# EAGLE design uniprog21 (EAGLE 6.4)

## Sheet 1 of 5: ZIF
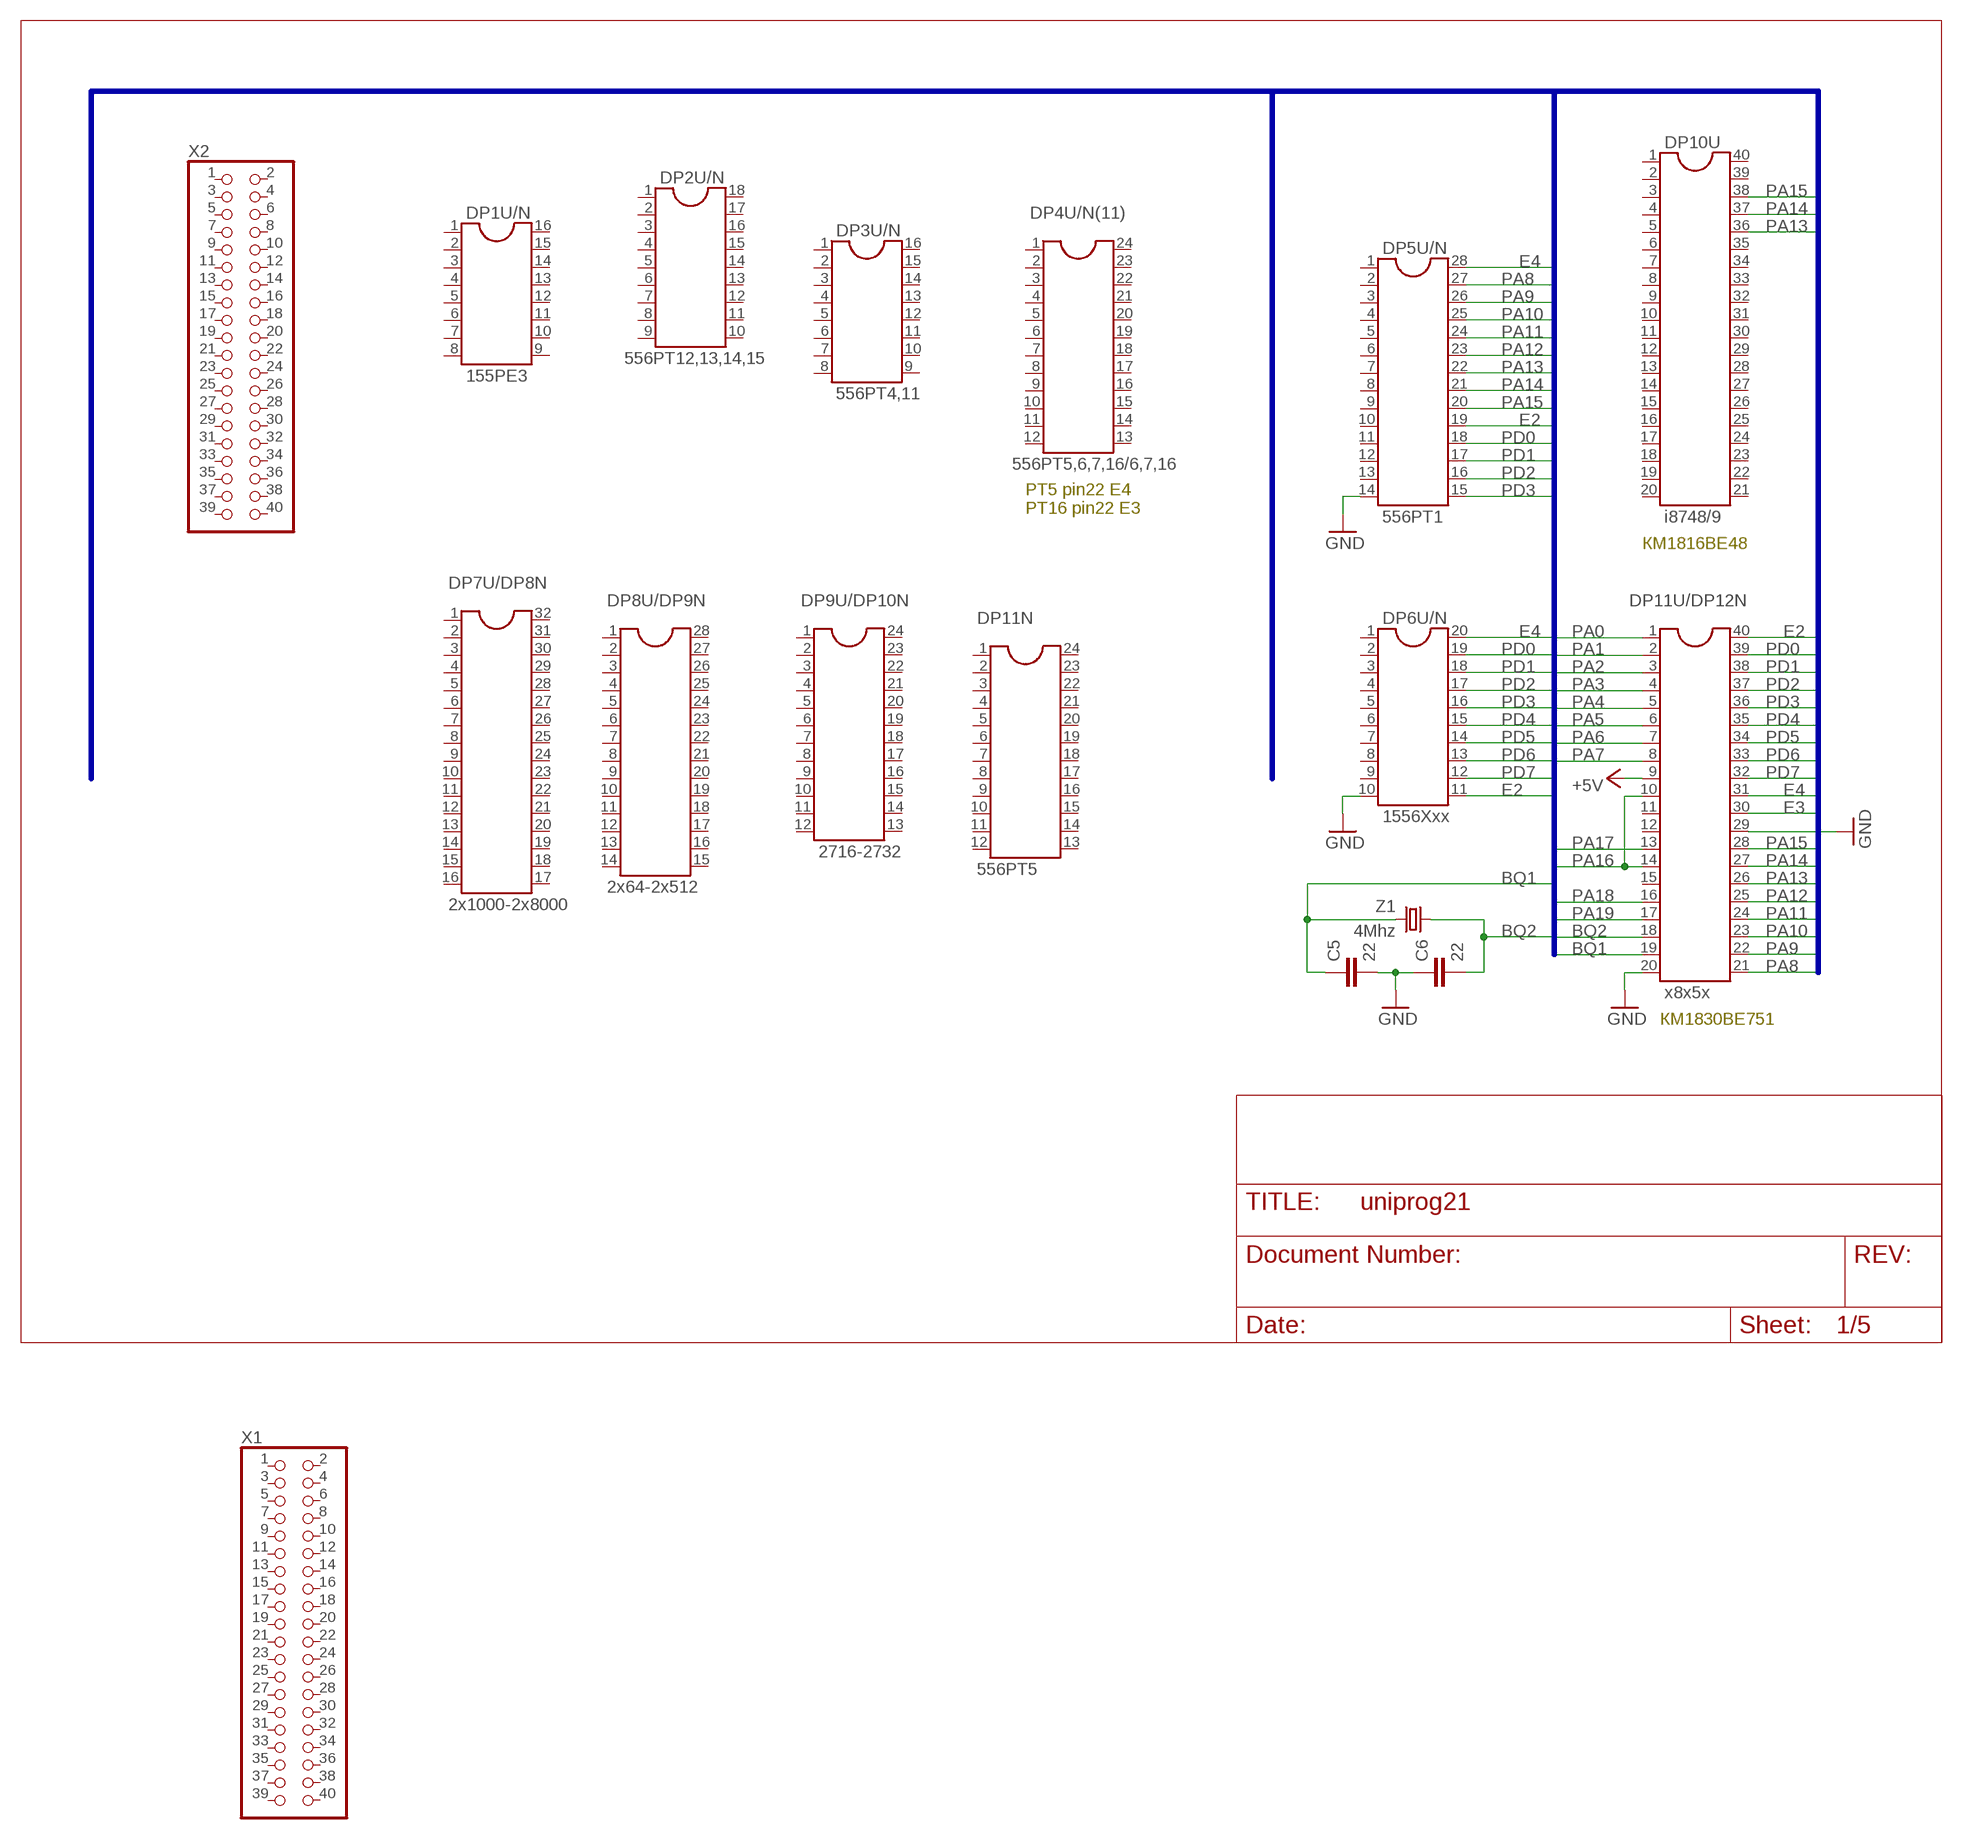
[diagram p0: schematic, sheet 1]

### Parts
C5  22  C-EUC0805  [C0805]
C6  22  C-EUC0805  [C0805]
DP1U/N  155РЕ3  DIL16S  [SOCKET-16]
DP2U/N  556РТ12,13,14,15  DIL18S  [SOCKET-18]
DP3U/N  556РТ4,11  DIL16S  [SOCKET-16]
DP4U/N(11)  556РТ5,6,7,16/6,7,16  DIL24-6  [DIL24-6]
DP5U/N  556РТ1  DIL28  [DIL28-6]
DP6U/N  1556Хxx  DIL20S  [SOCKET-20]
DP7U/DP8N  2x1000-2x8000  DIL32  [DIL32]
DP8U/DP9N  2x64-2x512  DIL28  [DIL28-6]
DP9U/DP10N  2716-2732  DIL24-6  [DIL24-6]
DP10U  i8748/9  DIL40  [DIL40]
DP11N  556РТ5  DIL24-6  [DIL24-6]
DP11U/DP12N  x8x5x  DIL40  [DIL40]
X1  PINHD-2X20  [2X20]
X2  PINHD-2X20  [2X20]
Z1  4Mhz  CRYSTALHC49U-LM  [HC49U-LM]

### Nets
+5V: DP11U/DP12N.9 ; also sheet 2,3,4
BQ1: C5.1 DP11U/DP12N.19 Z1.2
BQ2: C6.2 DP11U/DP12N.18 Z1.1
E2: DP5U/N.19 DP6U/N.11 DP11U/DP12N.40 ; also sheet 4
E3: DP11U/DP12N.30 ; also sheet 4
E4: DP5U/N.28 DP6U/N.20 DP11U/DP12N.31 ; also sheet 4
GND: C5.2 C6.1 DP5U/N.14 DP6U/N.10 DP11U/DP12N.20 DP11U/DP12N.29 ; also sheet 2,3,4
PA0: DP11U/DP12N.1 ; also sheet 5
PA1: DP11U/DP12N.2 ; also sheet 5
PA2: DP11U/DP12N.3
PA3: DP11U/DP12N.4
PA4: DP11U/DP12N.5
PA5: DP11U/DP12N.6
PA6: DP11U/DP12N.7
PA7: DP11U/DP12N.8
PA8: DP5U/N.27 DP11U/DP12N.21
PA9: DP5U/N.26 DP11U/DP12N.22
PA10: DP5U/N.25 DP11U/DP12N.23
PA11: DP5U/N.24 DP11U/DP12N.24
PA12: DP5U/N.23 DP11U/DP12N.25
PA13: DP5U/N.22 DP10U.36 DP11U/DP12N.26
PA14: DP5U/N.21 DP10U.37 DP11U/DP12N.27
PA15: DP5U/N.20 DP10U.38 DP11U/DP12N.28
PA16: DP11U/DP12N.10 DP11U/DP12N.14
PA17: DP11U/DP12N.13
PA18: DP11U/DP12N.16
PA19: DP11U/DP12N.17
PD0: DP5U/N.18 DP6U/N.19 DP11U/DP12N.39
PD1: DP5U/N.17 DP6U/N.18 DP11U/DP12N.38
PD2: DP5U/N.16 DP6U/N.17 DP11U/DP12N.37
PD3: DP5U/N.15 DP6U/N.16 DP11U/DP12N.36
PD4: DP6U/N.15 DP11U/DP12N.35
PD5: DP6U/N.14 DP11U/DP12N.34
PD6: DP6U/N.13 DP11U/DP12N.33
PD7: DP6U/N.12 DP11U/DP12N.32
Unconnected: DP1U/N.1 DP1U/N.2 DP1U/N.3 DP1U/N.4 DP1U/N.5 DP1U/N.6 DP1U/N.7 DP1U/N.8 DP1U/N.9 DP1U/N.10 DP1U/N.11 DP1U/N.12 DP1U/N.13 DP1U/N.14 DP1U/N.15 DP1U/N.16 DP2U/N.1 DP2U/N.2 DP2U/N.3 DP2U/N.4 DP2U/N.5 DP2U/N.6 DP2U/N.7 DP2U/N.8 DP2U/N.9 DP2U/N.10 DP2U/N.11 DP2U/N.12 DP2U/N.13 DP2U/N.14 DP2U/N.15 DP2U/N.16 DP2U/N.17 DP2U/N.18 DP3U/N.1 DP3U/N.2 DP3U/N.3 DP3U/N.4 DP3U/N.5 DP3U/N.6 DP3U/N.7 DP3U/N.8 DP3U/N.9 DP3U/N.10 DP3U/N.11 DP3U/N.12 DP3U/N.13 DP3U/N.14 DP3U/N.15 DP3U/N.16 DP4U/N(11).1 DP4U/N(11).2 DP4U/N(11).3 DP4U/N(11).4 DP4U/N(11).5 DP4U/N(11).6 DP4U/N(11).7 DP4U/N(11).8 DP4U/N(11).9 DP4U/N(11).10 DP4U/N(11).11 DP4U/N(11).12 DP4U/N(11).13 DP4U/N(11).14 DP4U/N(11).15 DP4U/N(11).16 DP4U/N(11).17 DP4U/N(11).18 DP4U/N(11).19 DP4U/N(11).20 DP4U/N(11).21 DP4U/N(11).22 DP4U/N(11).23 DP4U/N(11).24 DP5U/N.1 DP5U/N.2 DP5U/N.3 DP5U/N.4 DP5U/N.5 DP5U/N.6 DP5U/N.7 DP5U/N.8 DP5U/N.9 DP5U/N.10 DP5U/N.11 DP5U/N.12 DP5U/N.13 DP6U/N.1 DP6U/N.2 DP6U/N.3 DP6U/N.4 DP6U/N.5 DP6U/N.6 DP6U/N.7 DP6U/N.8 DP6U/N.9 DP7U/DP8N.1 DP7U/DP8N.2 DP7U/DP8N.3 DP7U/DP8N.4 DP7U/DP8N.5 DP7U/DP8N.6 DP7U/DP8N.7 DP7U/DP8N.8 DP7U/DP8N.9 DP7U/DP8N.10 DP7U/DP8N.11 DP7U/DP8N.12 DP7U/DP8N.13 DP7U/DP8N.14 DP7U/DP8N.15 DP7U/DP8N.16 DP7U/DP8N.17 DP7U/DP8N.18 DP7U/DP8N.19 DP7U/DP8N.20 DP7U/DP8N.21 DP7U/DP8N.22 DP7U/DP8N.23 DP7U/DP8N.24 DP7U/DP8N.25 DP7U/DP8N.26 DP7U/DP8N.27 DP7U/DP8N.28 DP7U/DP8N.29 DP7U/DP8N.30 DP7U/DP8N.31 DP7U/DP8N.32 DP8U/DP9N.1 DP8U/DP9N.2 DP8U/DP9N.3 DP8U/DP9N.4 DP8U/DP9N.5 DP8U/DP9N.6 DP8U/DP9N.7 DP8U/DP9N.8 DP8U/DP9N.9 DP8U/DP9N.10 DP8U/DP9N.11 DP8U/DP9N.12 DP8U/DP9N.13 DP8U/DP9N.14 DP8U/DP9N.15 DP8U/DP9N.16 DP8U/DP9N.17 DP8U/DP9N.18 DP8U/DP9N.19 DP8U/DP9N.20 DP8U/DP9N.21 DP8U/DP9N.22 DP8U/DP9N.23 DP8U/DP9N.24 DP8U/DP9N.25 DP8U/DP9N.26 DP8U/DP9N.27 DP8U/DP9N.28 DP9U/DP10N.1 DP9U/DP10N.2 DP9U/DP10N.3 DP9U/DP10N.4 DP9U/DP10N.5 DP9U/DP10N.6 DP9U/DP10N.7 DP9U/DP10N.8 DP9U/DP10N.9 DP9U/DP10N.10 DP9U/DP10N.11 DP9U/DP10N.12 DP9U/DP10N.13 DP9U/DP10N.14 DP9U/DP10N.15 DP9U/DP10N.16 DP9U/DP10N.17 DP9U/DP10N.18 DP9U/DP10N.19 DP9U/DP10N.20 DP9U/DP10N.21 DP9U/DP10N.22 DP9U/DP10N.23 DP9U/DP10N.24 DP10U.1 DP10U.2 DP10U.3 DP10U.4 DP10U.5 DP10U.6 DP10U.7 DP10U.8 DP10U.9 DP10U.10 DP10U.11 DP10U.12 DP10U.13 DP10U.14 DP10U.15 DP10U.16 DP10U.17 DP10U.18 DP10U.19 DP10U.20 DP10U.21 DP10U.22 DP10U.23 DP10U.24 DP10U.25 DP10U.26 DP10U.27 DP10U.28 DP10U.29 DP10U.30 DP10U.31 DP10U.32 DP10U.33 DP10U.34 DP10U.35 DP10U.39 DP10U.40 DP11N.1 DP11N.2 DP11N.3 DP11N.4 DP11N.5 DP11N.6 DP11N.7 DP11N.8 DP11N.9 DP11N.10 DP11N.11 DP11N.12 DP11N.13 DP11N.14 DP11N.15 DP11N.16 DP11N.17 DP11N.18 DP11N.19 DP11N.20 DP11N.21 DP11N.22 DP11N.23 DP11N.24 DP11U/DP12N.11 DP11U/DP12N.12 DP11U/DP12N.15 X1.1 X1.2 X1.3 X1.4 X1.5 X1.6 X1.7 X1.8 X1.9 X1.10 X1.11 X1.12 X1.13 X1.14 X1.15 X1.16 X1.17 X1.18 X1.19 X1.20 X1.21 X1.22 X1.23 X1.24 X1.25 X1.26 X1.27 X1.28 X1.29 X1.30 X1.31 X1.32 X1.33 X1.34 X1.35 X1.36 X1.37 X1.38 X1.39 X1.40 X2.1 X2.2 X2.3 X2.4 X2.5 X2.6 X2.7 X2.8 X2.9 X2.10 X2.11 X2.12 X2.13 X2.14 X2.15 X2.16 X2.17 X2.18 X2.19 X2.20 X2.21 X2.22 X2.23 X2.24 X2.25 X2.26 X2.27 X2.28 X2.29 X2.30 X2.31 X2.32 X2.33 X2.34 X2.35 X2.36 X2.37 X2.38 X2.39 X2.40

### Buses
BQ[1..2],E[2..4],PA[0..19],PD[0..7]

### Notes on the sheet
- РТ5 pin22 E4
  РТ16 pin22 E3
- КМ1816ВЕ48
- КМ1830ВЕ751

## Sheet 2 of 5
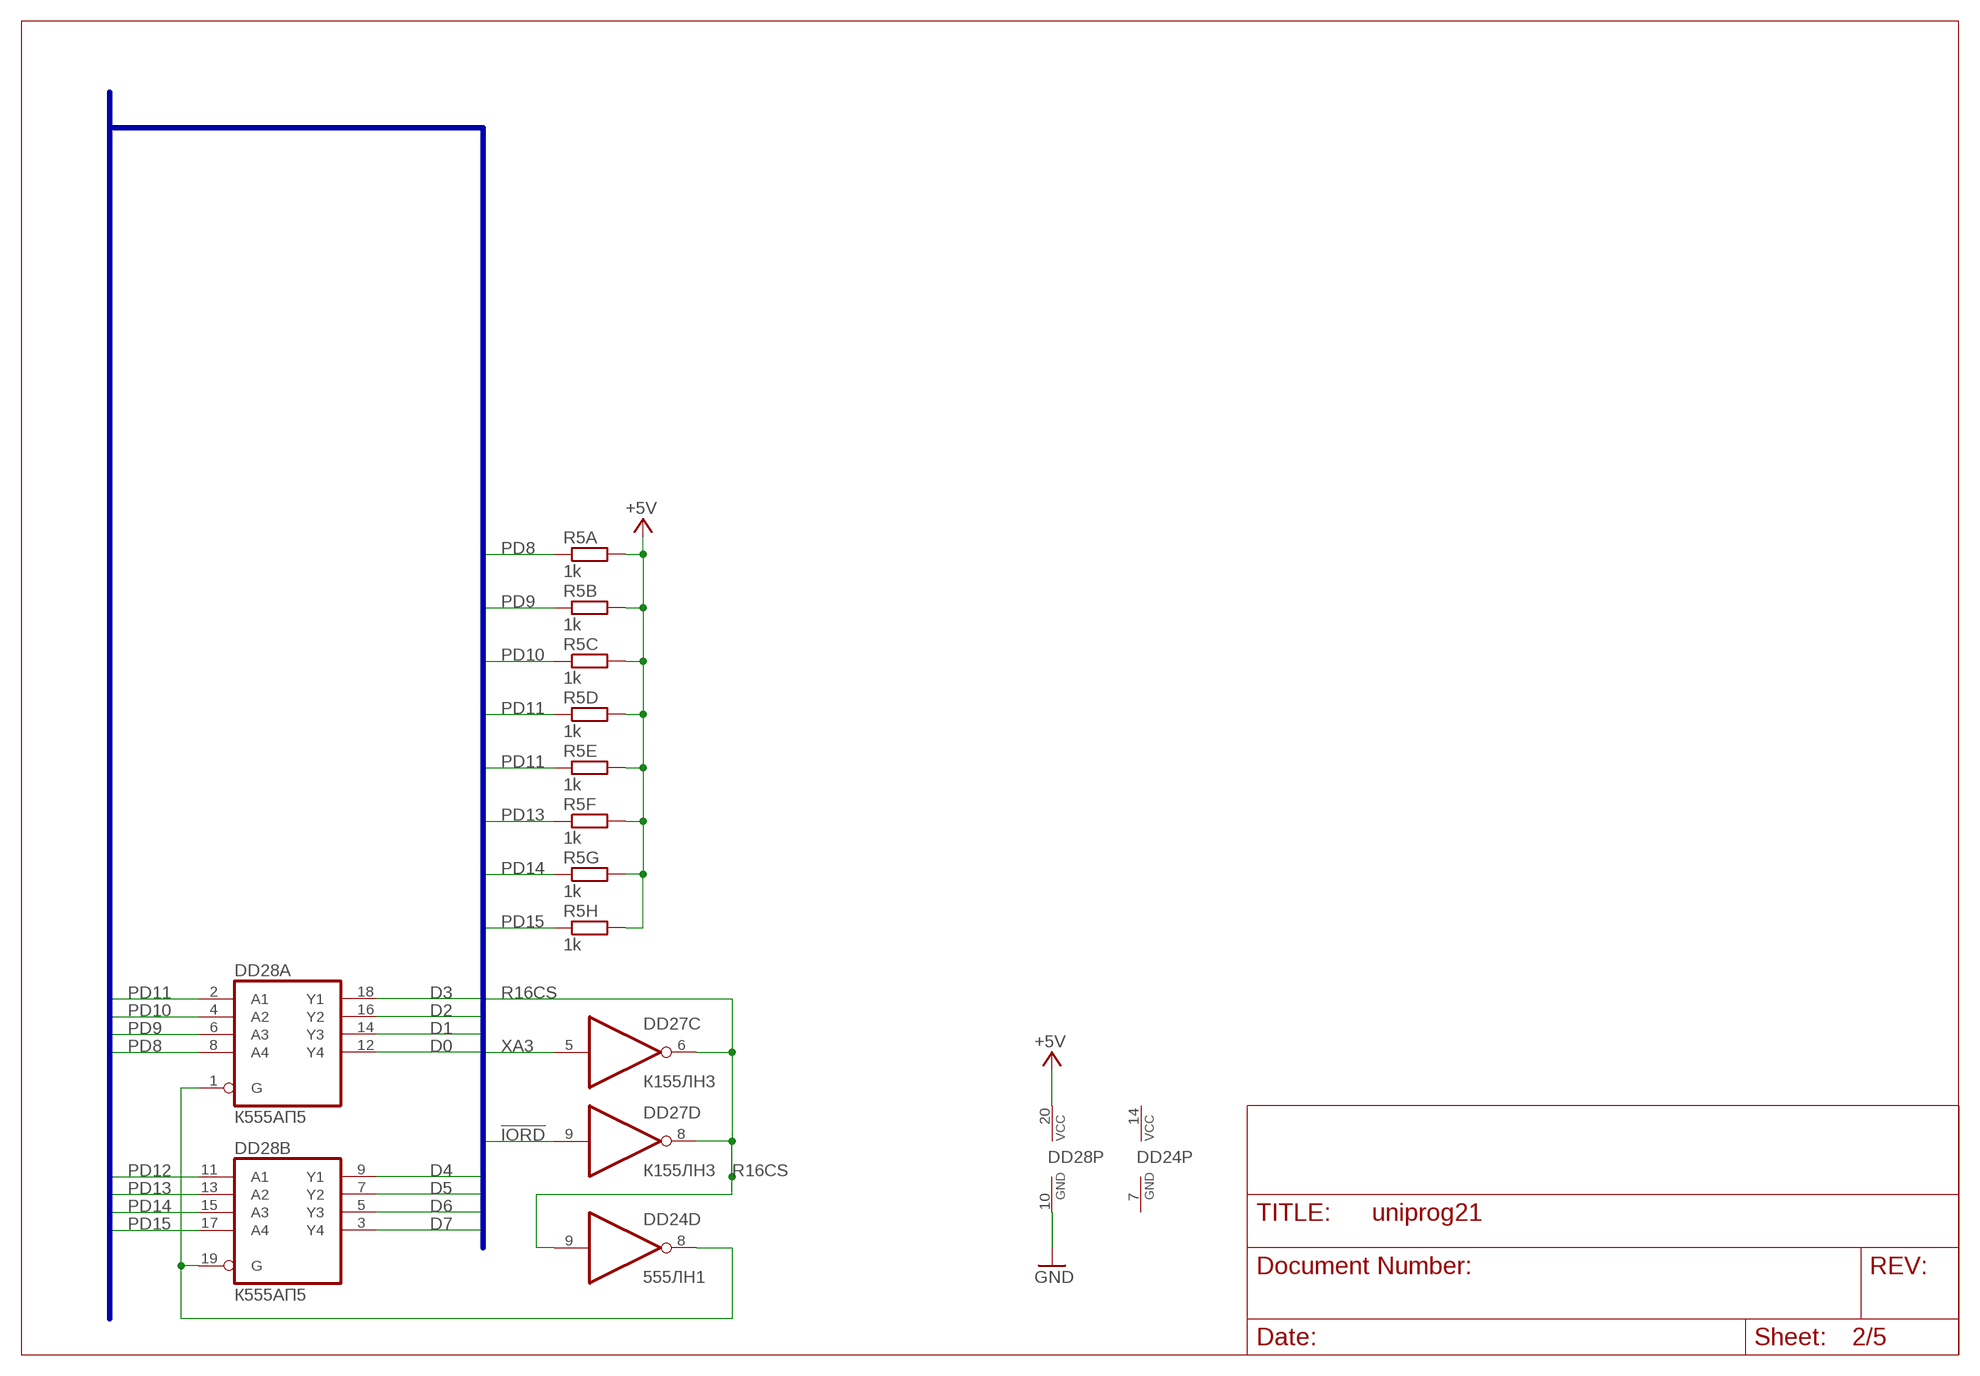
[diagram p1: schematic, sheet 2]

### Parts
DD24  555ЛН1  74LS04N  [DIL14]
DD27  К155ЛН3  7406N  [DIL14]
DD28  К555АП5  74LS244N  [DIL20]
R5A  1k  R-EU_M0805  [M0805]
R5B  1k  R-EU_M0805  [M0805]
R5C  1k  R-EU_M0805  [M0805]
R5D  1k  R-EU_M0805  [M0805]
R5E  1k  R-EU_M0805  [M0805]
R5F  1k  R-EU_M0805  [M0805]
R5G  1k  R-EU_M0805  [M0805]
R5H  1k  R-EU_M0805  [M0805]

### Nets
!IORD: DD27.9(D:I) ; also sheet 3
+5V: DD28.20(P:VCC) R5A.2 R5B.2 R5C.2 R5D.2 R5E.2 R5F.2 R5G.2 R5H.2 ; also sheet 1,3,4
D0: DD28.12(A:Y4) ; also sheet 3
D1: DD28.14(A:Y3) ; also sheet 3
D2: DD28.16(A:Y2) ; also sheet 3
D3: DD28.18(A:Y1) ; also sheet 3
D4: DD28.9(B:Y1) ; also sheet 3
D5: DD28.7(B:Y2) ; also sheet 3
D6: DD28.5(B:Y3) ; also sheet 3
D7: DD28.3(B:Y4) ; also sheet 3
GND: DD28.10(P:GND) ; also sheet 1,3,4
N$5: DD24.8(D:O) DD28.1(A:G) DD28.19(B:G)
PD8: DD28.8(A:A4) R5A.1
PD9: DD28.6(A:A3) R5B.1
PD10: DD28.4(A:A2) R5C.1
PD11: DD28.2(A:A1) R5D.1 R5E.1
PD12: DD28.11(B:A1)
PD13: DD28.13(B:A2) R5F.1
PD14: DD28.15(B:A3) R5G.1
PD15: DD28.17(B:A4) R5H.1
R16CS: DD24.9(D:I) DD27.6(C:O) DD27.8(D:O)
XA3: DD27.5(C:I) ; also sheet 3
Unconnected: DD24.1(A:I) DD24.2(A:O) DD24.3(B:I) DD24.4(B:O) DD24.5(C:I) DD24.6(C:O) DD24.12(F:O) DD24.13(F:I)

### Buses
D[0..7],!EN[1..4],P[64..95],PD[8..15],!IORD,R16CS,XA3

## Sheet 3 of 5: ВВ55
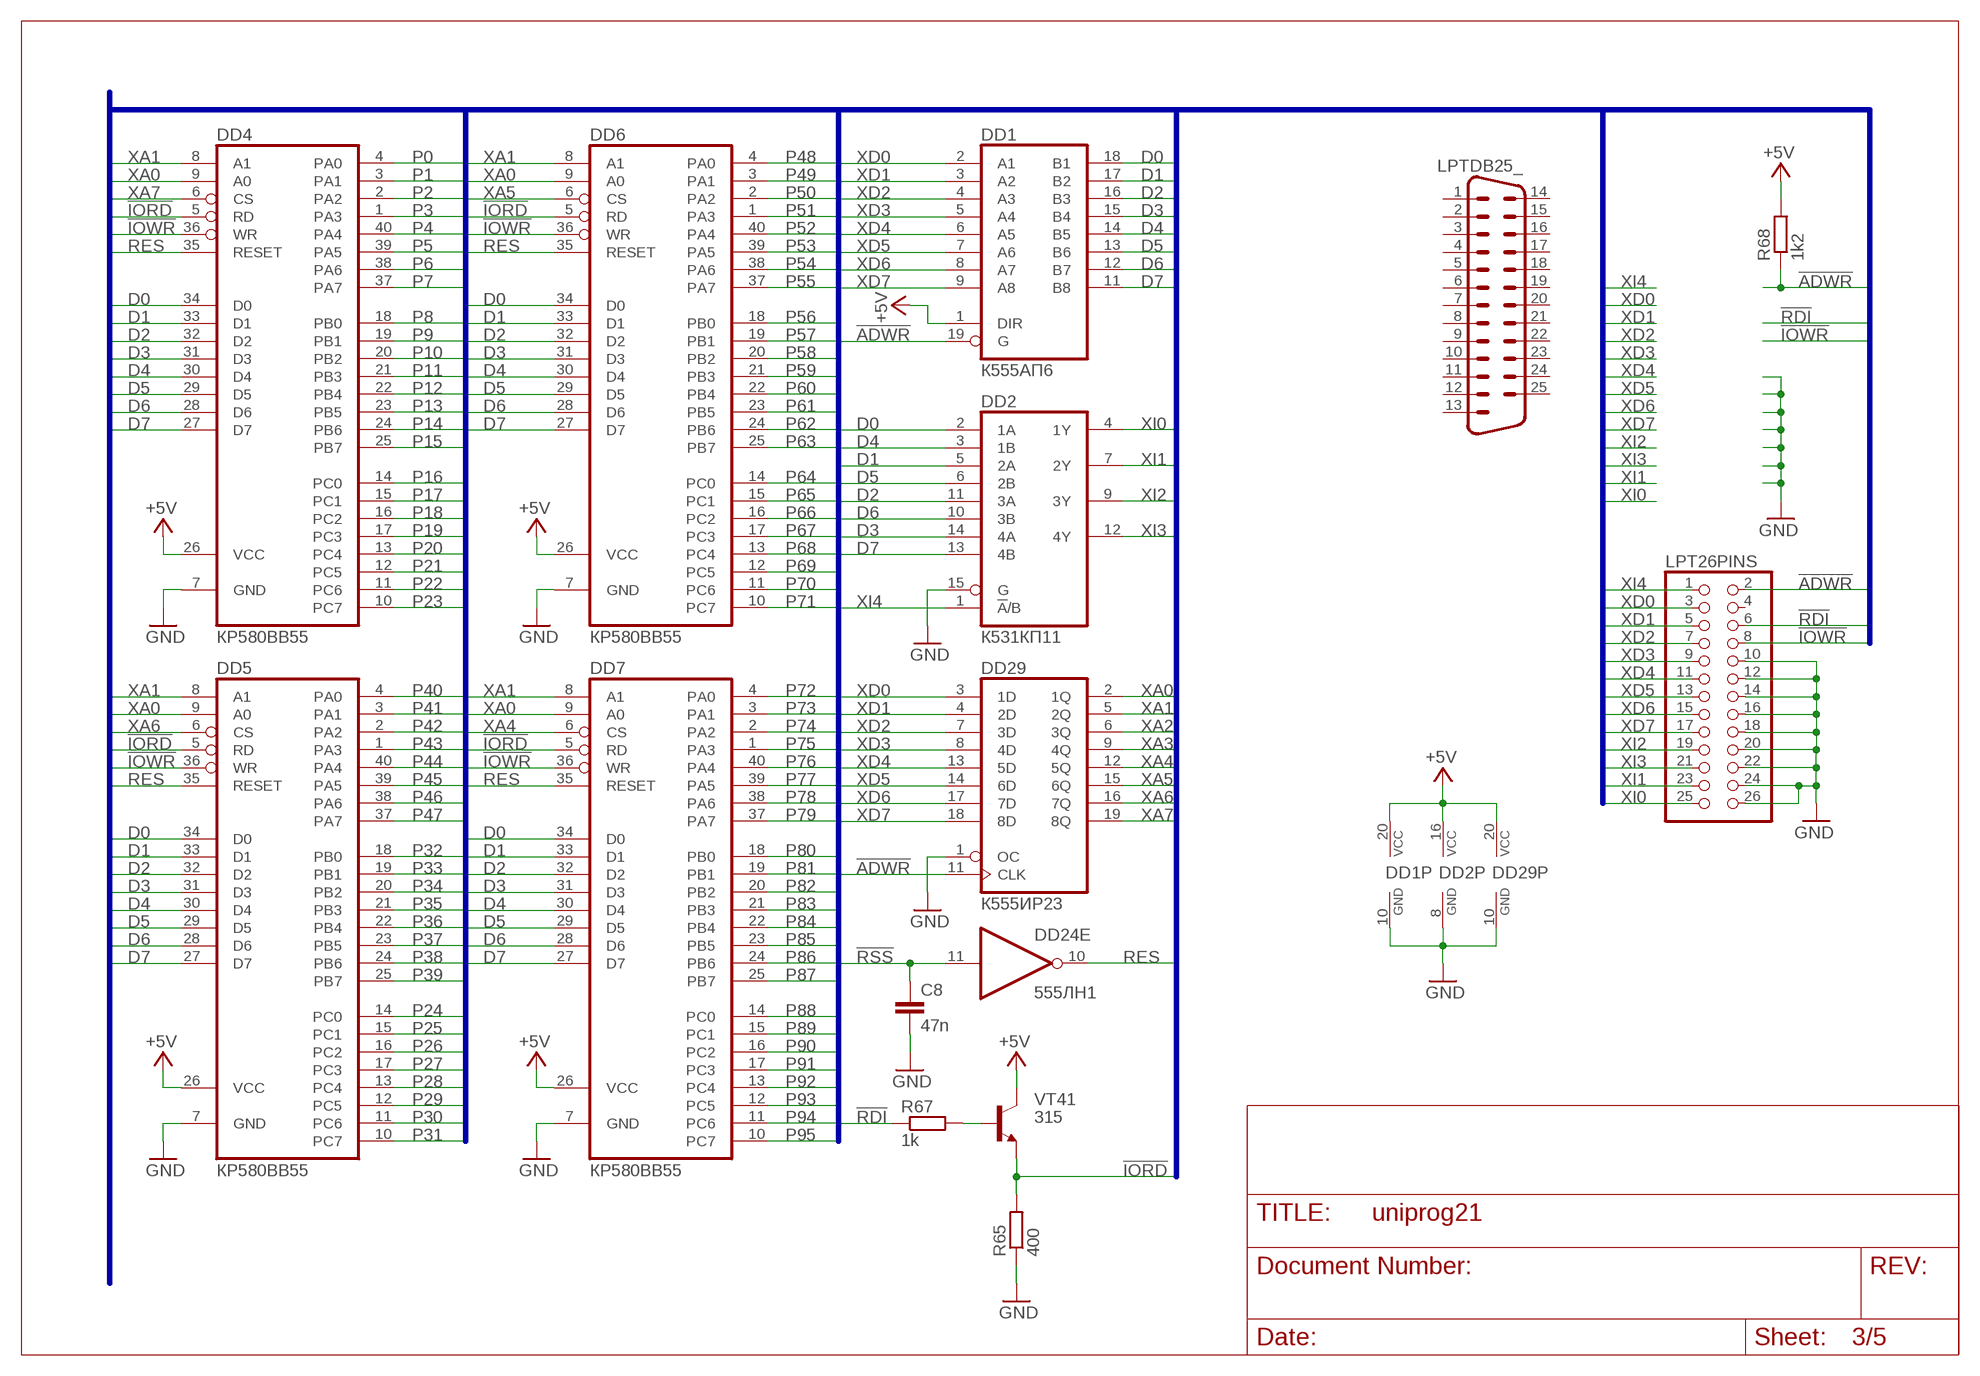
[diagram p2: schematic, sheet 3]

### Parts
C8  47n  C-EUC0805  [C0805]
DD1  К555АП6  74LS245N  [DIL20]
DD2  К531КП11  74S257N  [DIL16]
DD4  КР580ВВ55  82C55A  [DIL40]
DD5  КР580ВВ55  82C55A  [DIL40]
DD6  КР580ВВ55  82C55A  [DIL40]
DD7  КР580ВВ55  82C55A  [DIL40]
DD29  К555ИР23  74LS374N  [DIL20]
LPT26PINS  PINHD-2X13  [2X13]
LPTDB25_  M25HP  [M25HP]
R65  400  R-EU_R0805  [R0805]
R67  1k  R-EU_R0805  [R0805]
R68  1k2  R-EU_R0805  [R0805]
VT41  315  BJT_NPN_SOT23_BCE  [SOT23]

### Nets
!ADWR: DD1.19(G) DD29.11(CLK) LPT26PINS.2 R68.1
!IORD: DD4.5(RD) DD5.5(RD) DD6.5(RD) DD7.5(RD) R65.2 VT41.2(E) ; also sheet 2
!IOWR: DD4.36(WR) DD5.36(WR) DD6.36(WR) DD7.36(WR) LPT26PINS.8
!RDI: LPT26PINS.6 R67.1
!RSS: C8.1 DD24.11(E:I)
+5V: DD1.1(DIR) DD1.20(VCC) DD2.16(VCC) DD4.26(VCC) DD5.26(VCC) DD6.26(VCC) DD7.26(VCC) DD29.20(VCC) R68.2 VT41.3(C) ; also sheet 1,2,4
D0: DD1.18(B1) DD2.2(1A) DD4.34(D0) DD5.34(D0) DD6.34(D0) DD7.34(D0) ; also sheet 2
D1: DD1.17(B2) DD2.5(2A) DD4.33(D1) DD5.33(D1) DD6.33(D1) DD7.33(D1) ; also sheet 2
D2: DD1.16(B3) DD2.11(3A) DD4.32(D2) DD5.32(D2) DD6.32(D2) DD7.32(D2) ; also sheet 2
D3: DD1.15(B4) DD2.14(4A) DD4.31(D3) DD5.31(D3) DD6.31(D3) DD7.31(D3) ; also sheet 2
D4: DD1.14(B5) DD2.3(1B) DD4.30(D4) DD5.30(D4) DD6.30(D4) DD7.30(D4) ; also sheet 2
D5: DD1.13(B6) DD2.6(2B) DD4.29(D5) DD5.29(D5) DD6.29(D5) DD7.29(D5) ; also sheet 2
D6: DD1.12(B7) DD2.10(3B) DD4.28(D6) DD5.28(D6) DD6.28(D6) DD7.28(D6) ; also sheet 2
D7: DD1.11(B8) DD2.13(4B) DD4.27(D7) DD5.27(D7) DD6.27(D7) DD7.27(D7) ; also sheet 2
GND: C8.2 DD1.10(GND) DD2.8(GND) DD2.15(G) DD4.7(GND) DD5.7(GND) DD6.7(GND) DD7.7(GND) DD29.1(OC) DD29.10(GND) LPT26PINS.10 LPT26PINS.12 LPT26PINS.14 LPT26PINS.16 LPT26PINS.18 LPT26PINS.20 LPT26PINS.22 LPT26PINS.24 LPT26PINS.26 R65.1 ; also sheet 1,2,4
N$8: R67.2 VT41.1(B)
P0: DD4.4(PA0) ; also sheet 5
P1: DD4.3(PA1) ; also sheet 5
P2: DD4.2(PA2)
P3: DD4.1(PA3)
P4: DD4.40(PA4)
P5: DD4.39(PA5)
P6: DD4.38(PA6)
P7: DD4.37(PA7)
P8: DD4.18(PB0) ; also sheet 5
P9: DD4.19(PB1) ; also sheet 5
P10: DD4.20(PB2)
P11: DD4.21(PB3)
P12: DD4.22(PB4)
P13: DD4.23(PB5)
P14: DD4.24(PB6)
P15: DD4.25(PB7)
P16: DD4.14(PC0)
P17: DD4.15(PC1)
P18: DD4.16(PC2)
P19: DD4.17(PC3)
P20: DD4.13(PC4)
P21: DD4.12(PC5)
P22: DD4.11(PC6)
P23: DD4.10(PC7)
P24: DD5.14(PC0)
P25: DD5.15(PC1)
P26: DD5.16(PC2)
P27: DD5.17(PC3)
P28: DD5.13(PC4)
P29: DD5.12(PC5)
P30: DD5.11(PC6)
P31: DD5.10(PC7)
P32: DD5.18(PB0)
P33: DD5.19(PB1)
P34: DD5.20(PB2)
P35: DD5.21(PB3)
P36: DD5.22(PB4)
P37: DD5.23(PB5)
P38: DD5.24(PB6)
P39: DD5.25(PB7)
P40: DD5.4(PA0)
P41: DD5.3(PA1)
P42: DD5.2(PA2)
P43: DD5.1(PA3)
P44: DD5.40(PA4)
P45: DD5.39(PA5)
P46: DD5.38(PA6)
P47: DD5.37(PA7)
P48: DD6.4(PA0)
P49: DD6.3(PA1)
P50: DD6.2(PA2)
P51: DD6.1(PA3)
P52: DD6.40(PA4)
P53: DD6.39(PA5)
P54: DD6.38(PA6)
P55: DD6.37(PA7)
P56: DD6.18(PB0)
P57: DD6.19(PB1)
P58: DD6.20(PB2)
P59: DD6.21(PB3)
P60: DD6.22(PB4)
P61: DD6.23(PB5)
P62: DD6.24(PB6)
P63: DD6.25(PB7)
P64: DD6.14(PC0) ; also sheet 4
P65: DD6.15(PC1) ; also sheet 4
P66: DD6.16(PC2) ; also sheet 4
P67: DD6.17(PC3) ; also sheet 4
P68: DD6.13(PC4) ; also sheet 4
P69: DD6.12(PC5) ; also sheet 4
P70: DD6.11(PC6) ; also sheet 4
P71: DD6.10(PC7) ; also sheet 4
P72: DD7.4(PA0) ; also sheet 4
P73: DD7.3(PA1) ; also sheet 4
P74: DD7.2(PA2) ; also sheet 4
P75: DD7.1(PA3) ; also sheet 4
P76: DD7.40(PA4) ; also sheet 4
P77: DD7.39(PA5) ; also sheet 4
P78: DD7.38(PA6) ; also sheet 4
P79: DD7.37(PA7) ; also sheet 4
P80: DD7.18(PB0) ; also sheet 4
P81: DD7.19(PB1) ; also sheet 4
P82: DD7.20(PB2) ; also sheet 4
P83: DD7.21(PB3) ; also sheet 4
P84: DD7.22(PB4) ; also sheet 4
P85: DD7.23(PB5) ; also sheet 4
P86: DD7.24(PB6) ; also sheet 4
P87: DD7.25(PB7) ; also sheet 4
P88: DD7.14(PC0) ; also sheet 4
P89: DD7.15(PC1) ; also sheet 4
P90: DD7.16(PC2) ; also sheet 4
P91: DD7.17(PC3) ; also sheet 4
P92: DD7.13(PC4) ; also sheet 4
P93: DD7.12(PC5) ; also sheet 4
P94: DD7.11(PC6) ; also sheet 4
P95: DD7.10(PC7) ; also sheet 4
RES: DD4.35(RESET) DD5.35(RESET) DD6.35(RESET) DD7.35(RESET) DD24.10(E:O)
XA0: DD4.9(A0) DD5.9(A0) DD6.9(A0) DD7.9(A0) DD29.2(1Q)
XA1: DD4.8(A1) DD5.8(A1) DD6.8(A1) DD7.8(A1) DD29.5(2Q)
XA2: DD29.6(3Q)
XA3: DD29.9(4Q) ; also sheet 2
XA4: DD7.6(CS) DD29.12(5Q)
XA5: DD6.6(CS) DD29.15(6Q)
XA6: DD5.6(CS) DD29.16(7Q)
XA7: DD4.6(CS) DD29.19(8Q)
XD0: DD1.2(A1) DD29.3(1D) LPT26PINS.3
XD1: DD1.3(A2) DD29.4(2D) LPT26PINS.5
XD2: DD1.4(A3) DD29.7(3D) LPT26PINS.7
XD3: DD1.5(A4) DD29.8(4D) LPT26PINS.9
XD4: DD1.6(A5) DD29.13(5D) LPT26PINS.11
XD5: DD1.7(A6) DD29.14(6D) LPT26PINS.13
XD6: DD1.8(A7) DD29.17(7D) LPT26PINS.15
XD7: DD1.9(A8) DD29.18(8D) LPT26PINS.17
XI0: DD2.4(1Y) LPT26PINS.25
XI1: DD2.7(2Y) LPT26PINS.23
XI2: DD2.9(3Y) LPT26PINS.19
XI3: DD2.12(4Y) LPT26PINS.21
XI4: DD2.1(!A!/B) LPT26PINS.1
Unconnected: LPT26PINS.4 LPTDB25_.1 LPTDB25_.2 LPTDB25_.3 LPTDB25_.4 LPTDB25_.5 LPTDB25_.6 LPTDB25_.7 LPTDB25_.8 LPTDB25_.9 LPTDB25_.10 LPTDB25_.11 LPTDB25_.12 LPTDB25_.13 LPTDB25_.14 LPTDB25_.15 LPTDB25_.16 LPTDB25_.17 LPTDB25_.18 LPTDB25_.19 LPTDB25_.20 LPTDB25_.21 LPTDB25_.22 LPTDB25_.23 LPTDB25_.24 LPTDB25_.25

### Buses
D[0..7],P[0..95],XA[0..7],XD[0..7],XI[0..4],!ADWR,!IOWR,!IORD,RES,!RSS,!RDI

## Sheet 4 of 5: ЦАП
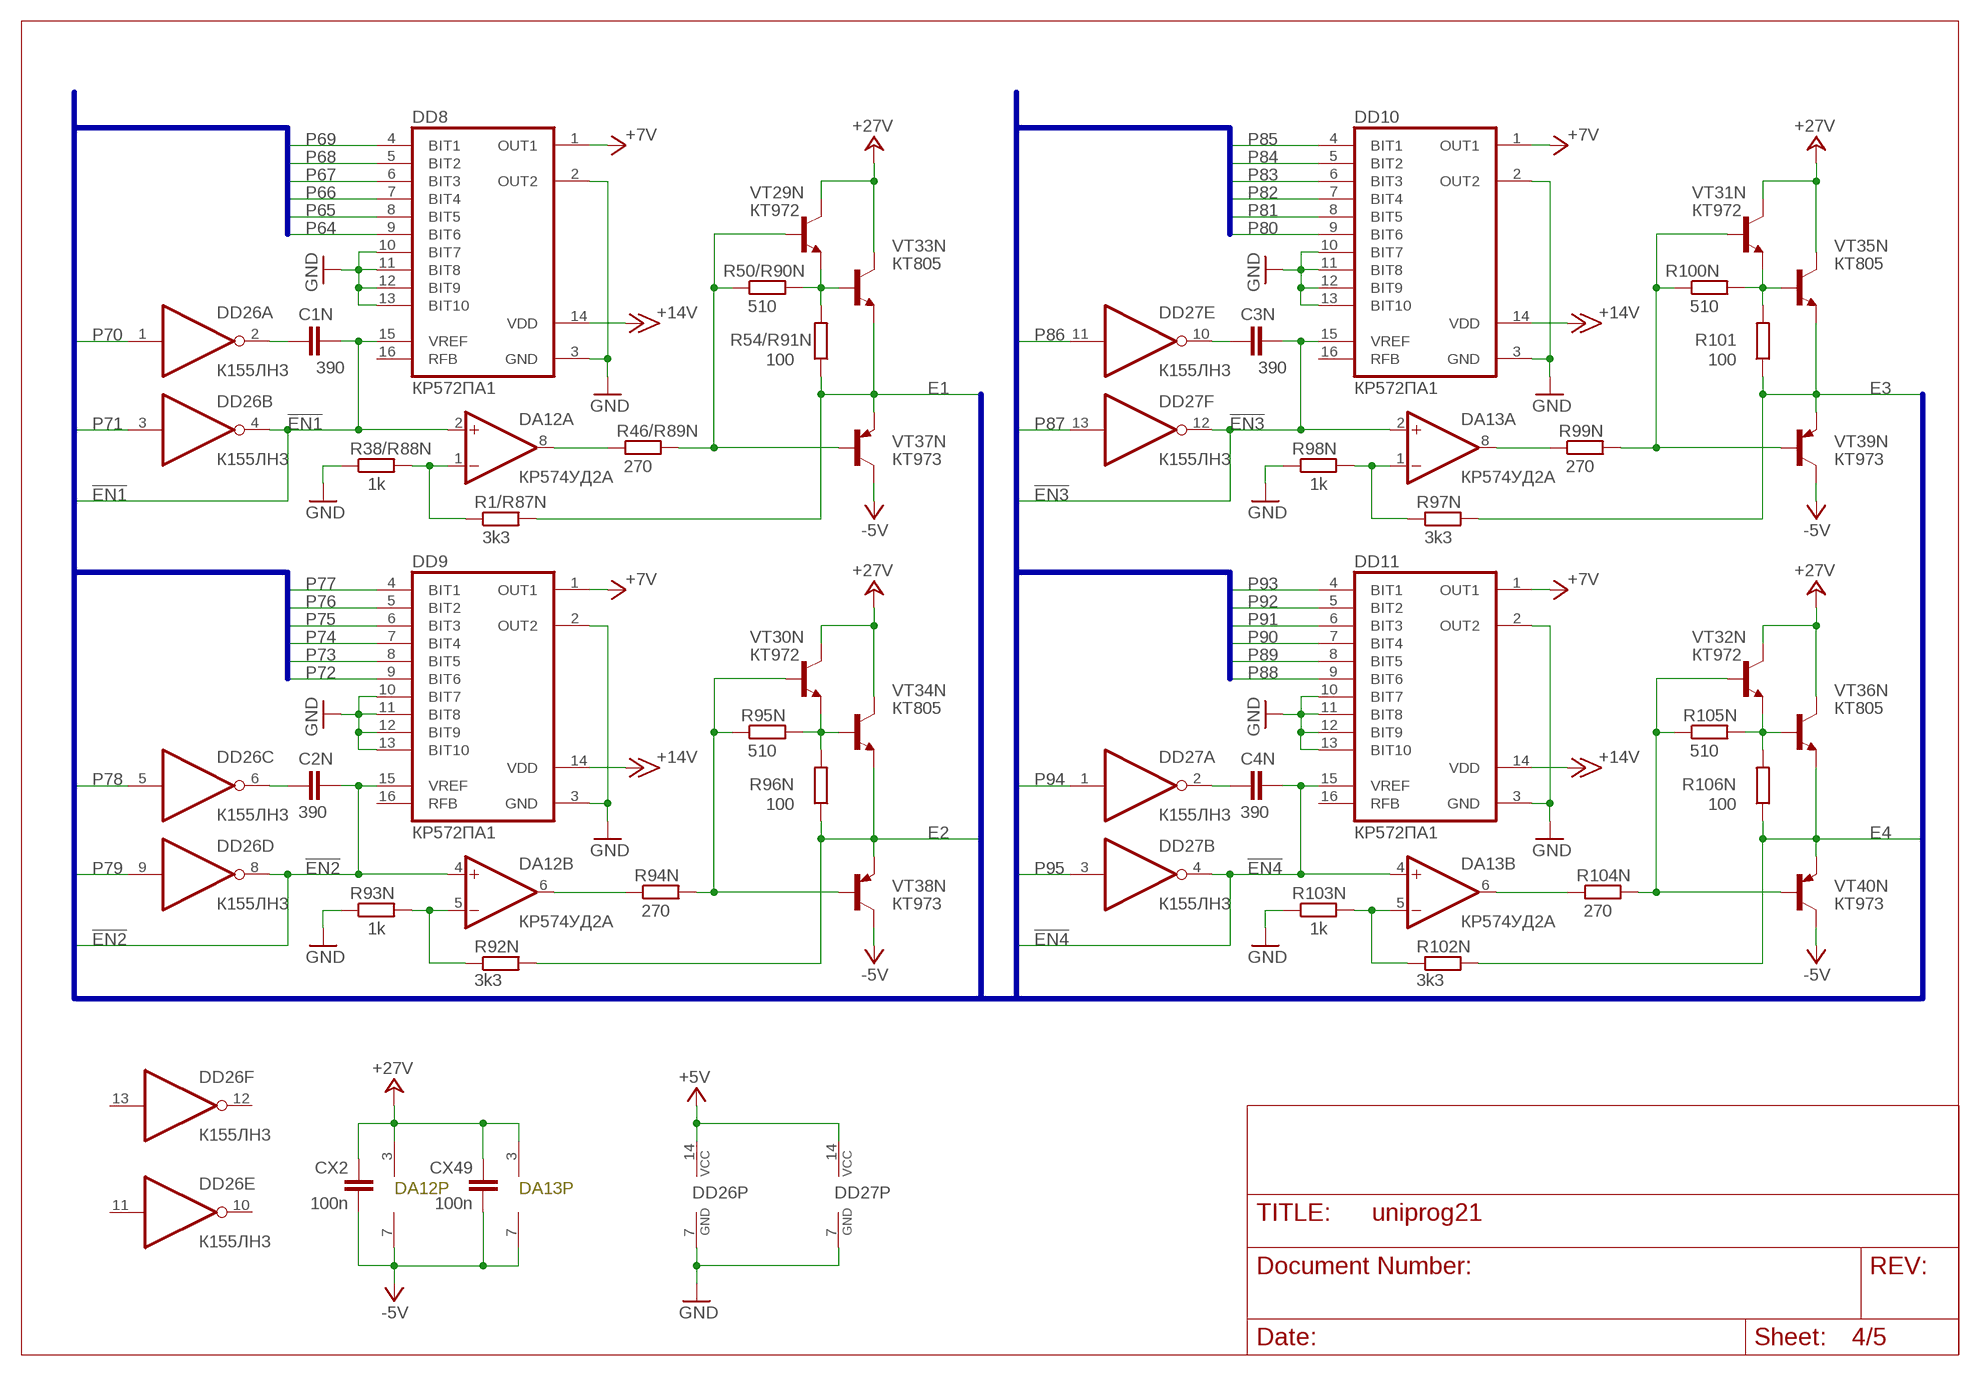
[diagram p3: schematic, sheet 4]

### Parts
C1N  390  C-EUC0805  [C0805]
C2N  390  C-EUC0805  [C0805]
C3N  390  C-EUC0805  [C0805]
C4N  390  C-EUC0805  [C0805]
CX2  100n  C-EUC0805  [C0805]
CX49  100n  C-EUC0805  [C0805]
DA12  КР574УД2А  [DIL08]
DA13  КР574УД2А  [DIL08]
DD8  КР572ПА1  MX7520JN  [DIL16]
DD9  КР572ПА1  MX7520JN  [DIL16]
DD10  КР572ПА1  MX7520JN  [DIL16]
DD11  КР572ПА1  MX7520JN  [DIL16]
DD26  К155ЛН3  7406N  [DIL14]
R1/R87N  3k3  R-EU_M0805  [M0805]
R38/R88N  1k  R-EU_M0805  [M0805]
R46/R89N  270  R-EU_M0805  [M0805]
R50/R90N  510  R-EU_M0805  [M0805]
R54/R91N  100  R-EU_M0805  [M0805]
R92N  3k3  R-EU_M0805  [M0805]
R93N  1k  R-EU_M0805  [M0805]
R94N  270  R-EU_M0805  [M0805]
R95N  510  R-EU_M0805  [M0805]
R96N  100  R-EU_M0805  [M0805]
R97N  3k3  R-EU_M0805  [M0805]
R98N  1k  R-EU_M0805  [M0805]
R99N  270  R-EU_M0805  [M0805]
R100N  510  R-EU_M0805  [M0805]
R101  100  R-EU_M0805  [M0805]
R102N  3k3  R-EU_M0805  [M0805]
R103N  1k  R-EU_M0805  [M0805]
R104N  270  R-EU_M0805  [M0805]
R105N  510  R-EU_M0805  [M0805]
R106N  100  R-EU_M0805  [M0805]
VT29N  КТ972  BJT_NPN_TO126_V_ECB  [TO126V]
VT30N  КТ972  BJT_NPN_TO126_V_ECB  [TO126V]
VT31N  КТ972  BJT_NPN_TO126_V_ECB  [TO126V]
VT32N  КТ972  BJT_NPN_TO126_V_ECB  [TO126V]
VT33N  КТ805  BJT_NPN_TO220_V_ECB  [TO220FV]
VT34N  КТ805  BJT_NPN_TO220_V_ECB  [TO220FV]
VT35N  КТ805  BJT_NPN_TO220_V_ECB  [TO220FV]
VT36N  КТ805  BJT_NPN_TO220_V_ECB  [TO220FV]
VT37N  КТ973  BJT_PNP_TO126_V_ECB  [TO126V]
VT38N  КТ973  BJT_PNP_TO126_V_ECB  [TO126V]
VT39N  КТ973  BJT_PNP_TO126_V_ECB  [TO126V]
VT40N  КТ973  BJT_PNP_TO126_V_ECB  [TO126V]

### Nets
!EN1: C1N.2 DA12.2(A:+IN) DD8.15(VREF) DD26.4(B:O)
!EN2: C2N.2 DA12.4(B:+IN) DD9.15(VREF) DD26.8(D:O)
!EN3: C3N.2 DA13.2(A:+IN) DD10.15(VREF) DD27.12(F:O)
!EN4: C4N.2 DA13.4(B:+IN) DD11.15(VREF) DD27.4(B:O)
+5V: DD26.14(P:VCC) DD27.14(P:VCC) ; also sheet 1,2,3
+7V: DD8.1(OUT1) DD9.1(OUT1) DD10.1(OUT1) DD11.1(OUT1)
+14V: DD8.14(VDD) DD9.14(VDD) DD10.14(VDD) DD11.14(VDD)
+27V: CX2.1 CX49.1 DA12.3(P:V+) DA13.3(P:V+) VT29N.2(C) VT30N.2(C) VT31N.2(C) VT32N.2(C) VT33N.2(C) VT34N.2(C) VT35N.2(C) VT36N.2(C)
-5V: CX2.2 CX49.2 DA12.7(P:V-) DA13.7(P:V-) VT37N.2(C) VT38N.2(C) VT39N.2(C) VT40N.2(C)
E1: R1/R87N.2 R54/R91N.1 VT33N.1(E) VT37N.1(E) ; also sheet 5
E2: R92N.2 R96N.1 VT34N.1(E) VT38N.1(E) ; also sheet 1
E3: R97N.2 R101.1 VT35N.1(E) VT39N.1(E) ; also sheet 1
E4: R102N.2 R106N.1 VT36N.1(E) VT40N.1(E) ; also sheet 1
GND: DD8.2(OUT2) DD8.3(GND) DD8.10(BIT7) DD8.11(BIT8) DD8.12(BIT9) DD8.13(BIT10) DD9.2(OUT2) DD9.3(GND) DD9.10(BIT7) DD9.11(BIT8) DD9.12(BIT9) DD9.13(BIT10) DD10.2(OUT2) DD10.3(GND) DD10.10(BIT7) DD10.11(BIT8) DD10.12(BIT9) DD10.13(BIT10) DD11.2(OUT2) DD11.3(GND) DD11.10(BIT7) DD11.11(BIT8) DD11.12(BIT9) DD11.13(BIT10) DD26.7(P:GND) DD27.7(P:GND) R38/R88N.1 R93N.1 R98N.1 R103N.1 ; also sheet 1,2,3
N$1: C1N.1 DD26.2(A:O)
N$2: C3N.1 DD27.10(E:O)
N$6: DA12.8(A:OUT) R46/R89N.1
N$7: DA13.8(A:OUT) R99N.1
N$15: DA12.1(A:-IN) R1/R87N.1 R38/R88N.2
N$16: R50/R90N.2 R54/R91N.2 VT29N.1(E) VT33N.3(B)
N$17: DA13.1(A:-IN) R97N.1 R98N.2
N$18: R100N.2 R101.2 VT31N.1(E) VT35N.3(B)
N$19: R46/R89N.2 R50/R90N.1 VT29N.3(B) VT37N.3(B)
N$22: C2N.1 DD26.6(C:O)
N$23: DA12.6(B:OUT) R94N.1
N$24: DA12.5(B:-IN) R92N.1 R93N.2
N$25: R95N.2 R96N.2 VT30N.1(E) VT34N.3(B)
N$26: R94N.2 R95N.1 VT30N.3(B) VT38N.3(B)
N$27: R99N.2 R100N.1 VT31N.3(B) VT39N.3(B)
N$28: C4N.1 DD27.2(A:O)
N$29: DA13.6(B:OUT) R104N.1
N$30: DA13.5(B:-IN) R102N.1 R103N.2
N$31: R105N.2 R106N.2 VT32N.1(E) VT36N.3(B)
N$32: R104N.2 R105N.1 VT32N.3(B) VT40N.3(B)
P64: DD8.9(BIT6) ; also sheet 3
P65: DD8.8(BIT5) ; also sheet 3
P66: DD8.7(BIT4) ; also sheet 3
P67: DD8.6(BIT3) ; also sheet 3
P68: DD8.5(BIT2) ; also sheet 3
P69: DD8.4(BIT1) ; also sheet 3
P70: DD26.1(A:I) ; also sheet 3
P71: DD26.3(B:I) ; also sheet 3
P72: DD9.9(BIT6) ; also sheet 3
P73: DD9.8(BIT5) ; also sheet 3
P74: DD9.7(BIT4) ; also sheet 3
P75: DD9.6(BIT3) ; also sheet 3
P76: DD9.5(BIT2) ; also sheet 3
P77: DD9.4(BIT1) ; also sheet 3
P78: DD26.5(C:I) ; also sheet 3
P79: DD26.9(D:I) ; also sheet 3
P80: DD10.9(BIT6) ; also sheet 3
P81: DD10.8(BIT5) ; also sheet 3
P82: DD10.7(BIT4) ; also sheet 3
P83: DD10.6(BIT3) ; also sheet 3
P84: DD10.5(BIT2) ; also sheet 3
P85: DD10.4(BIT1) ; also sheet 3
P86: DD27.11(E:I) ; also sheet 3
P87: DD27.13(F:I) ; also sheet 3
P88: DD11.9(BIT6) ; also sheet 3
P89: DD11.8(BIT5) ; also sheet 3
P90: DD11.7(BIT4) ; also sheet 3
P91: DD11.6(BIT3) ; also sheet 3
P92: DD11.5(BIT2) ; also sheet 3
P93: DD11.4(BIT1) ; also sheet 3
P94: DD27.1(A:I) ; also sheet 3
P95: DD27.3(B:I) ; also sheet 3
Unconnected: DD8.16(RFB) DD9.16(RFB) DD10.16(RFB) DD11.16(RFB) DD26.10(E:O) DD26.11(E:I) DD26.12(F:O) DD26.13(F:I)

### Buses
D[0..7],!EN[1..4],P[64..95],PD[8..15],!IORD,R16CS,XA3

### Notes on the sheet
- DA12P | DA13P

## Sheet 5 of 5
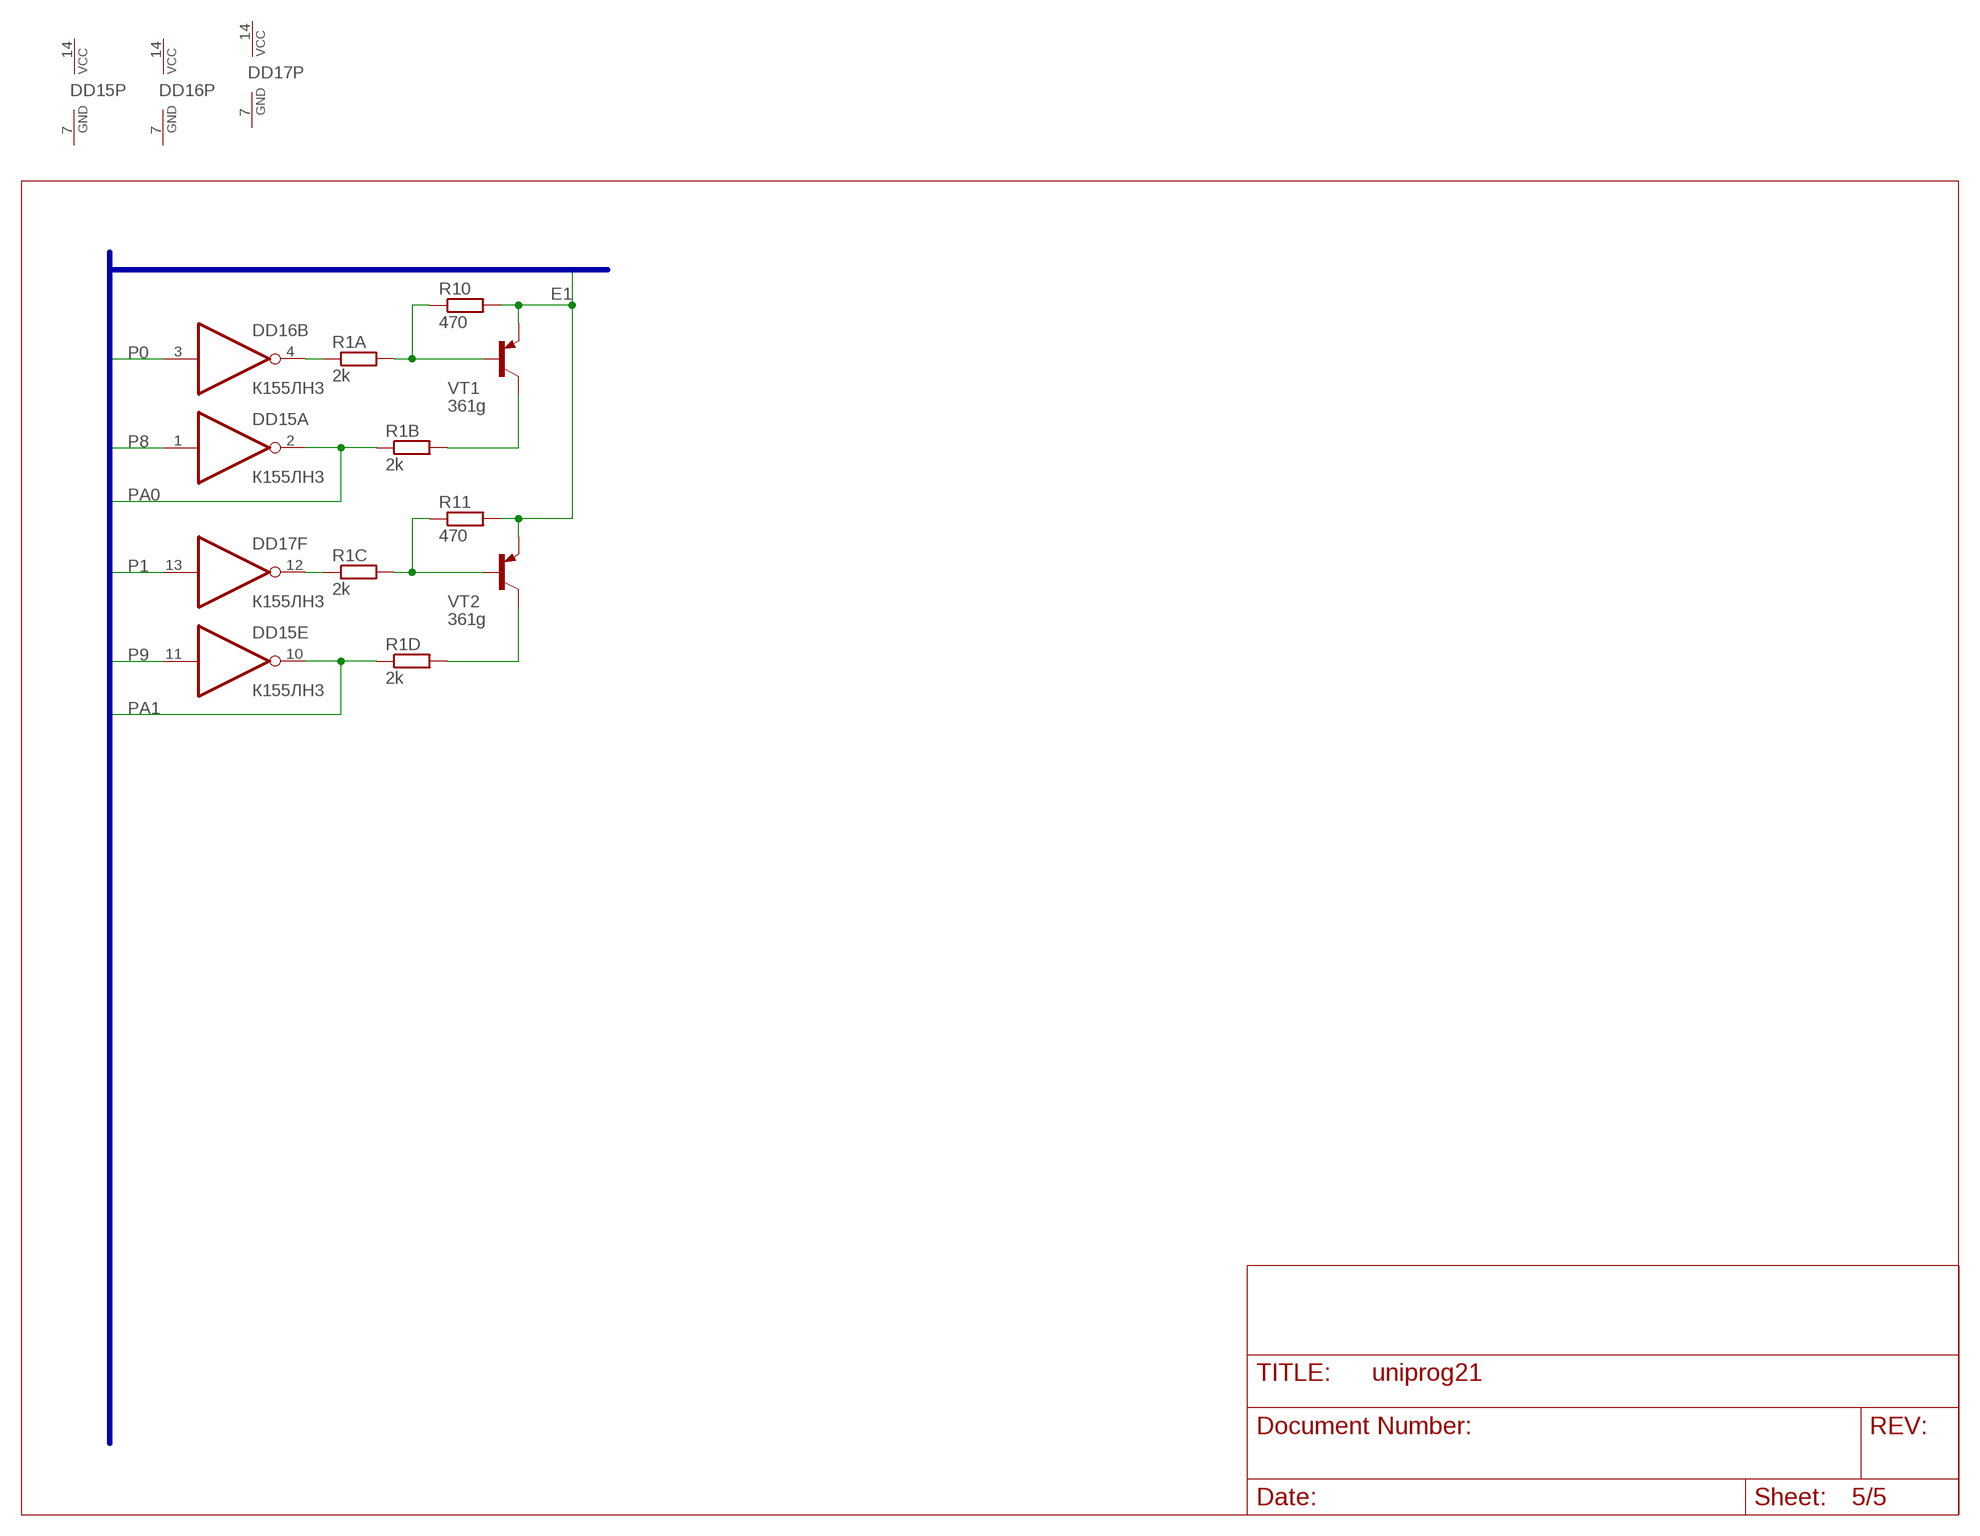
[diagram p4: schematic, sheet 5]

### Parts
DD15  К155ЛН3  7406N  [DIL14]
DD16  К155ЛН3  7406N  [DIL14]
DD17  К155ЛН3  7406N  [DIL14]
R1A  2k  R-EU_R0805  [R0805]
R1B  2k  R-EU_R0805  [R0805]
R1C  2k  R-EU_R0805  [R0805]
R1D  2k  R-EU_R0805  [R0805]
R10  470  R-EU_R0805  [R0805]
R11  470  R-EU_R0805  [R0805]
VT1  361g  BJT_PNP_SOT23_BCE  [SOT23]
VT2  361g  BJT_PNP_SOT23_BCE  [SOT23]

### Nets
E1: R10.2 R11.2 VT1.2(E) VT2.2(E) ; also sheet 4
N$9: DD16.4(B:O) R1A.1
N$10: R1B.2 VT1.3(C)
N$11: R1A.2 R10.1 VT1.1(B)
N$12: DD17.12(F:O) R1C.1
N$13: R1D.2 VT2.3(C)
N$14: R1C.2 R11.1 VT2.1(B)
P0: DD16.3(B:I) ; also sheet 3
P1: DD17.13(F:I) ; also sheet 3
P8: DD15.1(A:I) ; also sheet 3
P9: DD15.11(E:I) ; also sheet 3
PA0: DD15.2(A:O) R1B.1 ; also sheet 1
PA1: DD15.10(E:O) R1D.1 ; also sheet 1
Unconnected: DD15.3(B:I) DD15.4(B:O) DD15.5(C:I) DD15.6(C:O) DD15.8(D:O) DD15.9(D:I) DD15.12(F:O) DD15.13(F:I) DD16.1(A:I) DD16.2(A:O) DD16.5(C:I) DD16.6(C:O) DD16.8(D:O) DD16.9(D:I) DD16.10(E:O) DD16.11(E:I) DD16.12(F:O) DD16.13(F:I) DD17.1(A:I) DD17.2(A:O) DD17.3(B:I) DD17.4(B:O) DD17.5(C:I) DD17.6(C:O) DD17.8(D:O) DD17.9(D:I) DD17.10(E:O) DD17.11(E:I)

### Buses
E1,P[0..95],PA[0..15]

## Power pins joined to a net without a drawn wire
GND: DD15.7(P:GND) DD16.7(P:GND) DD17.7(P:GND) DD24.7(P:GND)
VCC: DD15.14(P:VCC) DD16.14(P:VCC) DD17.14(P:VCC) DD24.14(P:VCC)

## Library data of the parts
C1N C2N C3N C4N C5 C6 C8 CX2 CX49 = rcl:C-EU: CAPACITOR, European symbol
DA12 DA13 = ОУ:КР574УД2: OP AMP
DD1 = 74xx-eu:74*245: Octal BUS TRANSCEIVER, 3-state
DD2 = 74xx-eu:74*257: Quadruple 2-to 1 line data SELECTOR/MULTIPLEXER
DD4-DD7 = micro-intel:82C55A: MICROCOMPUTER/PERIPHERAL DEVICE; MF: INTERSIL; MPN: IP82C55AZ; OC_FARNELL: 1562050; OC_NEWARK: 79K6939
DD8-DD11 = maxim:MX7520JN: DIGITAL/ANALOG CONVERTER; MPN: MX7520JN+; OC_FARNELL: unknown; OC_NEWARK: 99K3894
DD15-DD17 DD26 DD27 = 74xx-eu:74*06: Hex INVERTER, open collector high-voltage output
DD24 = 74xx-eu:74*04: Hex INVERTER
DD28 = 74xx-eu:74*244: Octal BUFFER and LINE DRIVER, 3-state
DD29 = 74xx-eu:74*374: Octal D type transparent LATCH, edge triggered
DP1U/N DP3U/N = ic-package:DIL16: Dual In Line / Socket
DP2U/N = ic-package:DIL18: Dual In Line / Socket
DP4U/N(11) DP9U/DP10N DP11N = ic-package:DIL24: Dual In Line
DP5U/N DP8U/DP9N = ic-package:DIL28: Dual In Line
DP6U/N = ic-package:DIL20: Dual In Line / Socket
DP7U/DP8N = ic-package:DIL32: Dual In Line
DP10U DP11U/DP12N = ic-package:DIL40: Dual In Line
LPT26PINS = Разъёмы штырьковые 2.54мм:PINHD-2X13: PIN HEADER
LPTDB25_ = con-subd:M25: SUB-D; OC_FARNELL: unknown; OC_NEWARK: unknown
R1/R87N R1A R1B R1C R1D R5A R5B R5C R5D R5E R5F R5G R5H R10 R11 R38/R88N R46/R89N R50/R90N R54/R91N R65 R67 R68 R92N R93N R94N R95N R96N R97N R98N R99N R100N R101 R102N R103N R104N R105N R106N = rcl:R-EU_: RESISTOR, European symbol
VT1 VT2 VT37N VT38N VT39N VT40N = m_transistor:BJT_PNP: PNP Transistror КТ3107* CBE BD138 ECB BC847 SOT23 BCE
VT29N VT30N VT31N VT32N VT33N VT34N VT35N VT36N VT41 = m_transistor:BJT_NPN: NPN Transistor 13005 TO-220 BCE КТ805 TO-220 ECB КТ3102*М TO-92 CBE МП37 ТО-5 BC847 SOT23 BCE
X1 X2 = Разъёмы штырьковые 2.54мм:PINHD-2X20: PIN HEADER
Z1 = crystal:CRYSTAL: CRYSTAL; OC_FARNELL: 1666956; OC_NEWARK: unknown

## Board
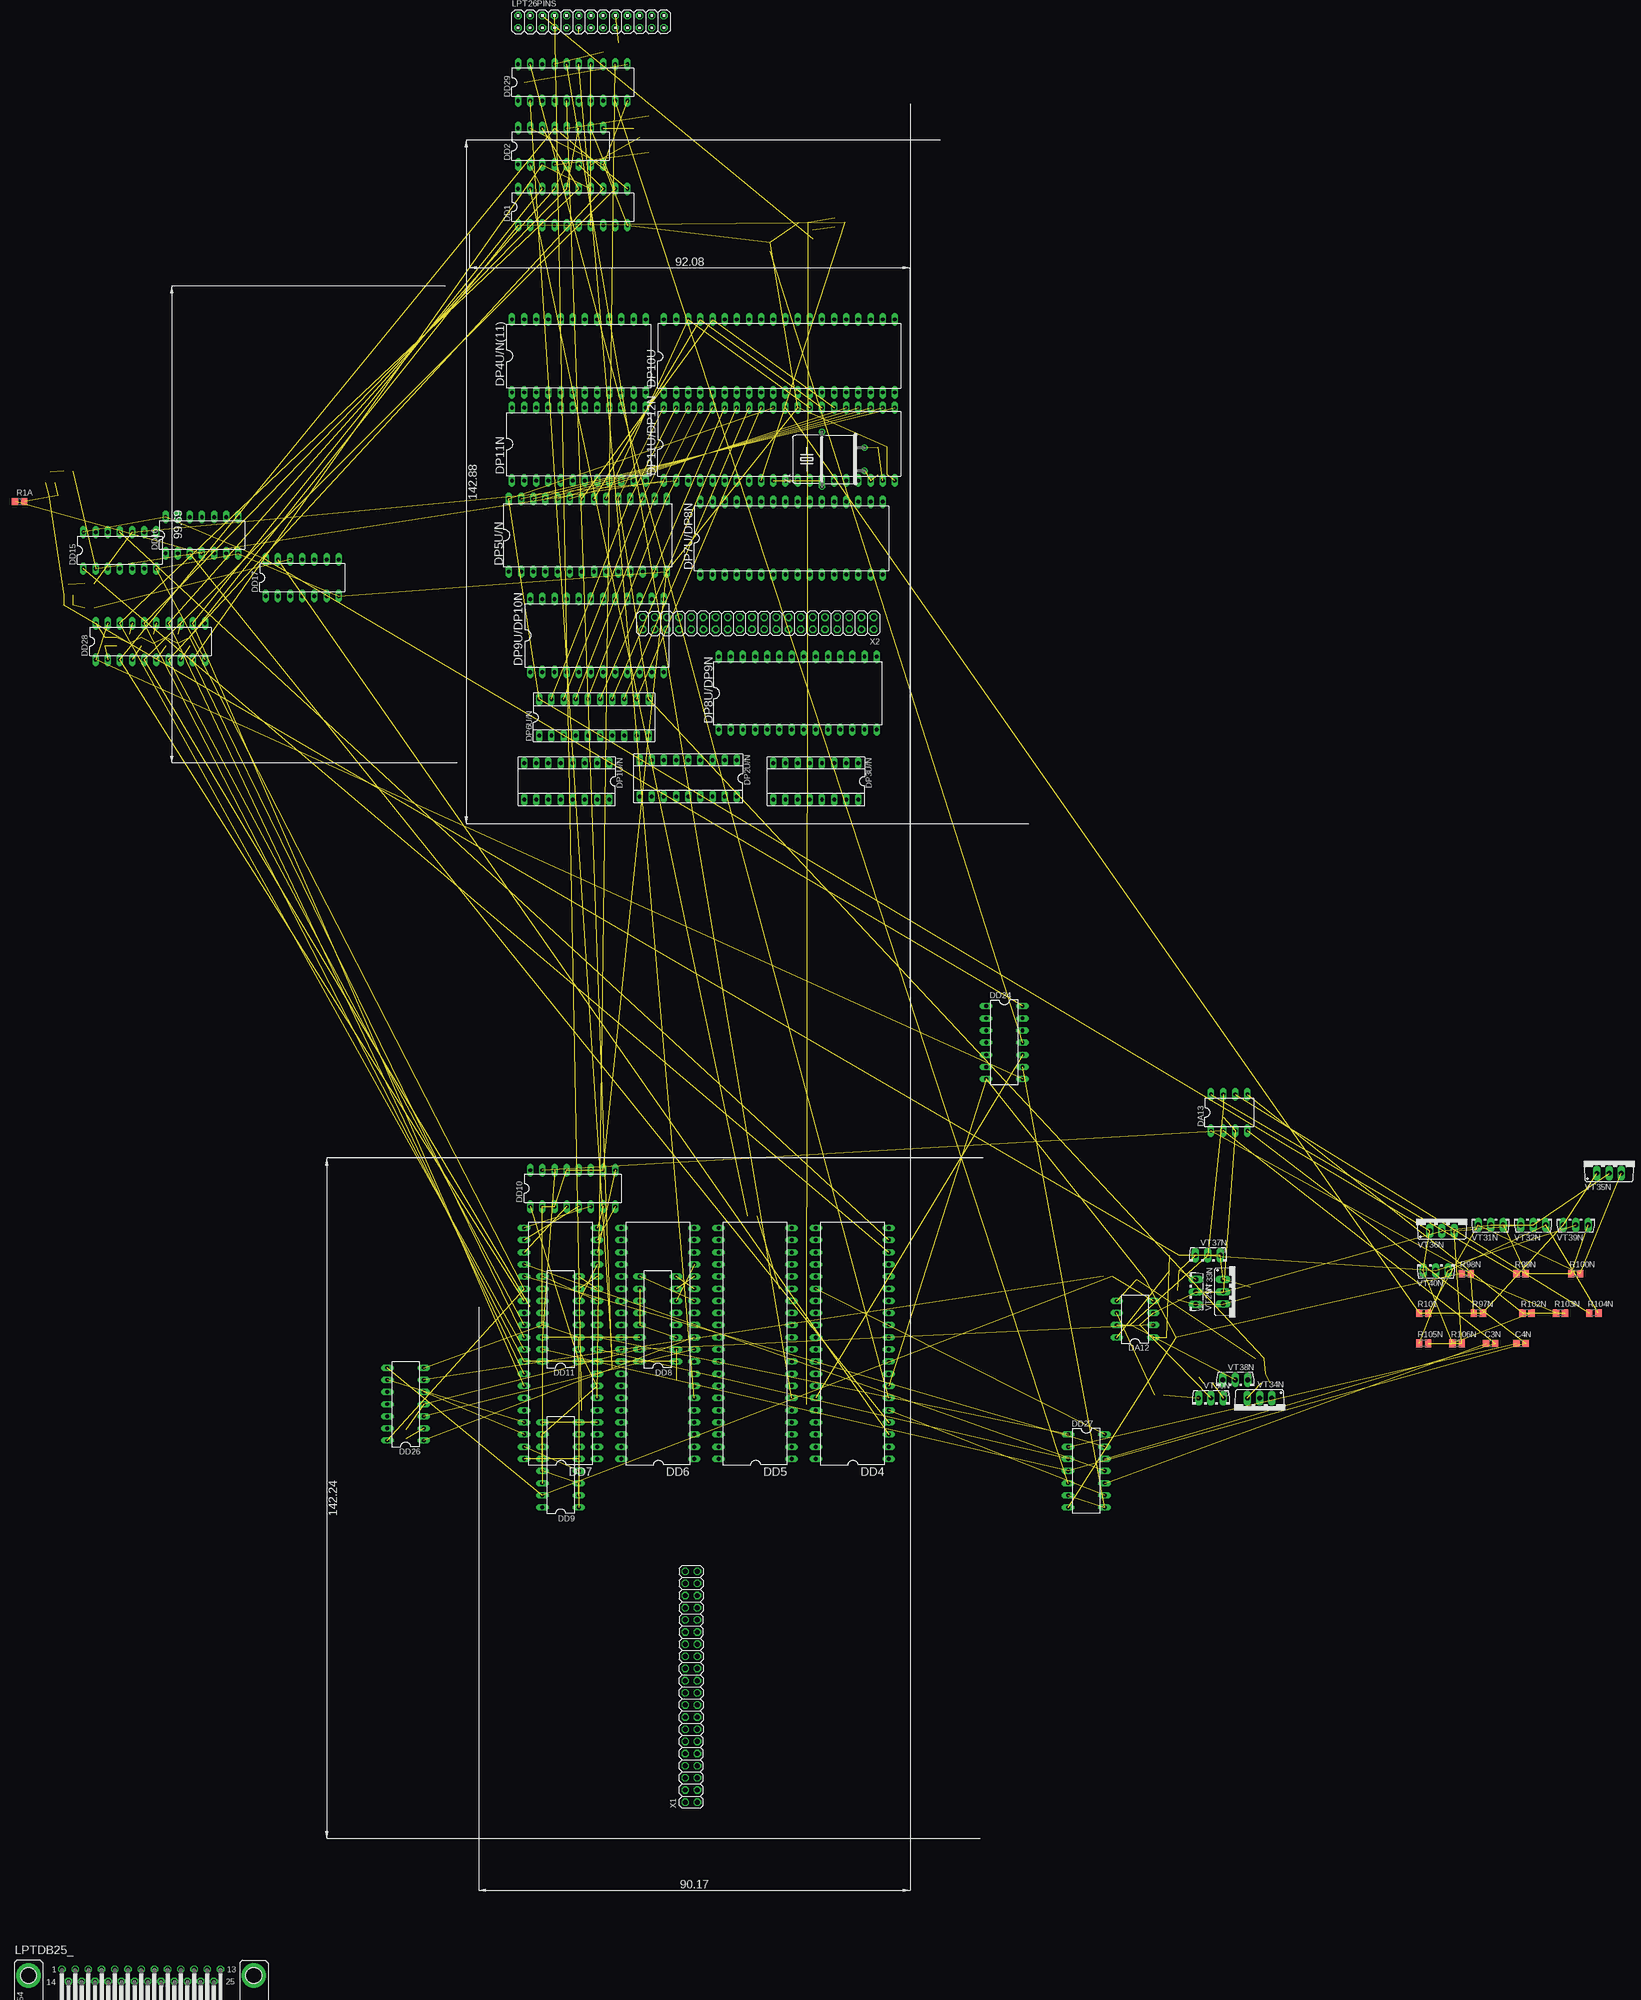
[diagram p5: board, top side]
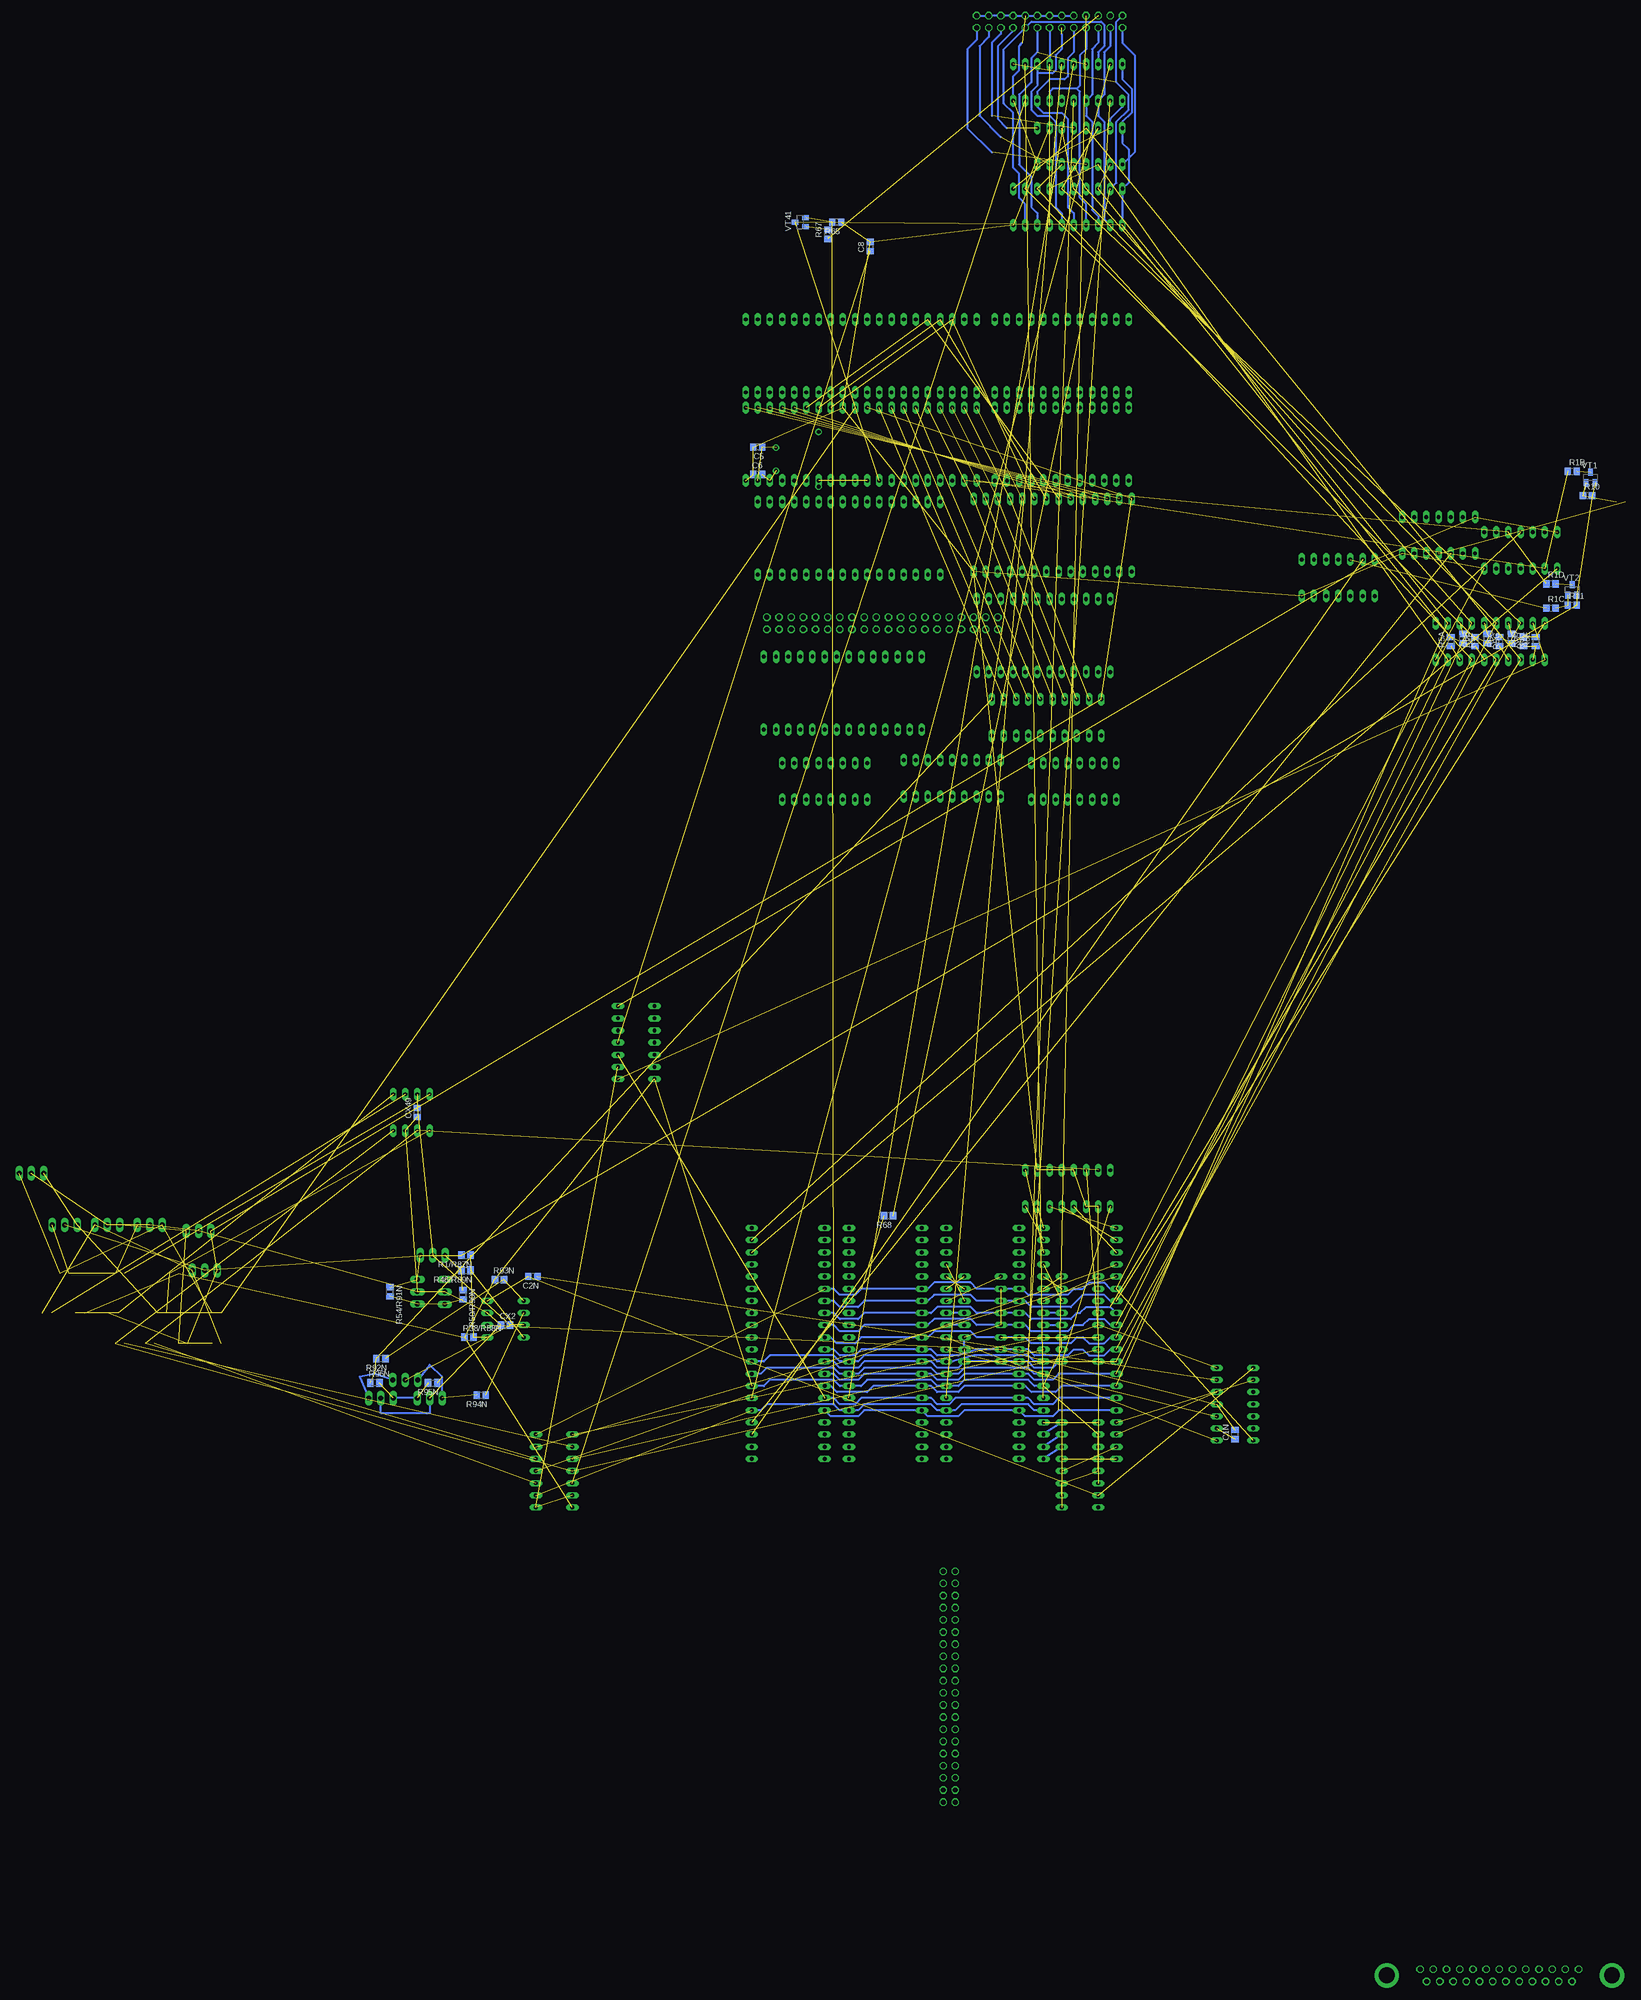
[diagram p6: board, bottom side, seen from below]

No outline drawn. Coordinates in mm, seen from the top.
Copper layers (1*16): Top 0.035mm / dielectric 1.5mm / Bottom 0.035mm
Design rules "default": minimum track width 10mil, minimum drill 24mil, track to track 8mil, track to pad 8mil, pad to pad 8mil, via to via 8mil, smd to smd 8mil, copper to edge 40mil, drill to drill 8mil, minimum pad ring 10mil, minimum via ring 8mil, stop-mask expansion 4mil, vias tented up to drill 0mil, thermal gap 10mil

### Footprints (pad centres in the part's own frame; a part is rotated, then mirrored left to right if it is on the bottom)
C0805 = smd 1.3 x 1.5: 1 -0.95,0; 2 0.95,0
DIL08 = drill 0.813 long: 1 -3.81,-3.81; 2 -1.27,-3.81; 3 1.27,-3.81; 4 3.81,-3.81; 5 3.81,3.81; 6 1.27,3.81; 7 -1.27,3.81; 8 -3.81,3.81
DIL20 = drill 0.813 long: 1 -11.43,-3.81; 2 -8.89,-3.81; 3 -6.35,-3.81; 4 -3.81,-3.81; 5 -1.27,-3.81; 6 1.27,-3.81; 7 3.81,-3.81; 8 6.35,-3.81; 9 8.89,-3.81; 10 11.43,-3.81; 11 11.43,3.81; 12 8.89,3.81; 13 6.35,3.81; 14 3.81,3.81; 15 1.27,3.81; 16 -1.27,3.81; 17 -3.81,3.81; 18 -6.35,3.81; 19 -8.89,3.81; 20 -11.43,3.81
DIL16 = drill 0.813 long: 1 -8.89,-3.81; 2 -6.35,-3.81; 3 -3.81,-3.81; 4 -1.27,-3.81; 5 1.27,-3.81; 6 3.81,-3.81; 7 6.35,-3.81; 8 8.89,-3.81; 9 8.89,3.81; 10 6.35,3.81; 11 3.81,3.81; 12 1.27,3.81; 13 -1.27,3.81; 14 -3.81,3.81; 15 -6.35,3.81; 16 -8.89,3.81
DIL40 = drill 0.813 long: 1 -24.13,-7.62; 2 -21.59,-7.62; 3 -19.05,-7.62; 4 -16.51,-7.62; 5 -13.97,-7.62; 6 -11.43,-7.62; 7 -8.89,-7.62; 8 -6.35,-7.62; 9 -3.81,-7.62; 10 -1.27,-7.62; 11 1.27,-7.62; 12 3.81,-7.62; 13 6.35,-7.62; 14 8.89,-7.62; 15 11.43,-7.62; 16 13.97,-7.62; 17 16.51,-7.62; 18 19.05,-7.62; 19 21.59,-7.62; 20 24.13,-7.62; 21 24.13,7.62; 22 21.59,7.62; 23 19.05,7.62; 24 16.51,7.62; 25 13.97,7.62; 26 11.43,7.62; 27 8.89,7.62; 28 6.35,7.62; 29 3.81,7.62; 30 1.27,7.62; 31 -1.27,7.62; 32 -3.81,7.62; 33 -6.35,7.62; 34 -8.89,7.62; 35 -11.43,7.62; 36 -13.97,7.62; 37 -16.51,7.62; 38 -19.05,7.62; 39 -21.59,7.62; 40 -24.13,7.62
DIL14 = drill 0.813 long: 1 -7.62,-3.81; 2 -5.08,-3.81; 3 -2.54,-3.81; 4 0,-3.81; 5 2.54,-3.81; 6 5.08,-3.81; 7 7.62,-3.81; 8 7.62,3.81; 9 5.08,3.81; 10 2.54,3.81; 11 0,3.81; 12 -2.54,3.81; 13 -5.08,3.81; 14 -7.62,3.81
SOCKET-16 = drill 0.813 long: 1 -8.89,-3.81; 2 -6.35,-3.81; 3 -3.81,-3.81; 4 -1.27,-3.81; 5 1.27,-3.81; 6 3.81,-3.81; 7 6.35,-3.81; 8 8.89,-3.81; 9 8.89,3.81; 10 6.35,3.81; 11 3.81,3.81; 12 1.27,3.81; 13 -1.27,3.81; 14 -3.81,3.81; 15 -6.35,3.81; 16 -8.89,3.81
SOCKET-18 = drill 0.813 long: 1 -10.16,-3.81; 2 -7.62,-3.81; 3 -5.08,-3.81; 4 -2.54,-3.81; 5 0,-3.81; 6 2.54,-3.81; 7 5.08,-3.81; 8 7.62,-3.81; 9 10.16,-3.81; 10 10.16,3.81; 11 7.62,3.81; 12 5.08,3.81; 13 2.54,3.81; 14 0,3.81; 15 -2.54,3.81; 16 -5.08,3.81; 17 -7.62,3.81; 18 -10.16,3.81
DIL24-6 = drill 0.813 long: 1 -13.97,-7.62; 2 -11.43,-7.62; 3 -8.89,-7.62; 4 -6.35,-7.62; 5 -3.81,-7.62; 6 -1.27,-7.62; 7 1.27,-7.62; 8 3.81,-7.62; 9 6.35,-7.62; 10 8.89,-7.62; 11 11.43,-7.62; 12 13.97,-7.62; 13 13.97,7.62; 14 11.43,7.62; 15 8.89,7.62; 16 6.35,7.62; 17 3.81,7.62; 18 1.27,7.62; 19 -1.27,7.62; 20 -3.81,7.62; 21 -6.35,7.62; 22 -8.89,7.62; 23 -11.43,7.62; 24 -13.97,7.62
DIL28-6 = drill 0.813 long: 1 -16.51,-7.62; 2 -13.97,-7.62; 3 -11.43,-7.62; 4 -8.89,-7.62; 5 -6.35,-7.62; 6 -3.81,-7.62; 7 -1.27,-7.62; 8 1.27,-7.62; 9 3.81,-7.62; 10 6.35,-7.62; 11 8.89,-7.62; 12 11.43,-7.62; 13 13.97,-7.62; 14 16.51,-7.62; 15 16.51,7.62; 16 13.97,7.62; 17 11.43,7.62; 18 8.89,7.62; 19 6.35,7.62; 20 3.81,7.62; 21 1.27,7.62; 22 -1.27,7.62; 23 -3.81,7.62; 24 -6.35,7.62; 25 -8.89,7.62; 26 -11.43,7.62; 27 -13.97,7.62; 28 -16.51,7.62
SOCKET-20 = drill 0.813 long: 1 -11.43,-3.81; 2 -8.89,-3.81; 3 -6.35,-3.81; 4 -3.81,-3.81; 5 -1.27,-3.81; 6 1.27,-3.81; 7 3.81,-3.81; 8 6.35,-3.81; 9 8.89,-3.81; 10 11.43,-3.81; 11 11.43,3.81; 12 8.89,3.81; 13 6.35,3.81; 14 3.81,3.81; 15 1.27,3.81; 16 -1.27,3.81; 17 -3.81,3.81; 18 -6.35,3.81; 19 -8.89,3.81; 20 -11.43,3.81
DIL32 = drill 0.813 long: 1 -19.05,-7.62; 2 -16.51,-7.62; 3 -13.97,-7.62; 4 -11.43,-7.62; 5 -8.89,-7.62; 6 -6.35,-7.62; 7 -3.81,-7.62; 8 -1.27,-7.62; 9 1.27,-7.62; 10 3.81,-7.62; 11 6.35,-7.62; 12 8.89,-7.62; 13 11.43,-7.62; 14 13.97,-7.62; 15 16.51,-7.62; 16 19.05,-7.62; 17 19.05,7.62; 18 16.51,7.62; 19 13.97,7.62; 20 11.43,7.62; 21 8.89,7.62; 22 6.35,7.62; 23 3.81,7.62; 24 1.27,7.62; 25 -1.27,7.62; 26 -3.81,7.62; 27 -6.35,7.62; 28 -8.89,7.62; 29 -11.43,7.62; 30 -13.97,7.62; 31 -16.51,7.62; 32 -19.05,7.62
2X13 = drill 1.016 octagon: 1 -15.24,-1.27; 2 -15.24,1.27; 3 -12.7,-1.27; 4 -12.7,1.27; 5 -10.16,-1.27; 6 -10.16,1.27; 7 -7.62,-1.27; 8 -7.62,1.27; 9 -5.08,-1.27; 10 -5.08,1.27; 11 -2.54,-1.27; 12 -2.54,1.27; 13 0,-1.27; 14 0,1.27; 15 2.54,-1.27; 16 2.54,1.27; 17 5.08,-1.27; 18 5.08,1.27; 19 7.62,-1.27; 20 7.62,1.27; 21 10.16,-1.27; 22 10.16,1.27; 23 12.7,-1.27; 24 12.7,1.27; 25 15.24,-1.27; 26 15.24,1.27
M25HP = drill 1.016 octagon: 1 -16.561,1.27; 2 -13.792,1.27; 3 -11.049,1.27; 4 -8.28,1.27; 5 -5.512,1.27; 6 -2.769,1.27; 7 0,1.27; 8 2.769,1.27; 9 5.512,1.27; 10 8.28,1.27; 11 11.049,1.27; 12 13.792,1.27; 13 16.561,1.27; 14 -15.189,-1.27; 15 -12.421,-1.27; 16 -9.652,-1.27; 17 -6.909,-1.27; 18 -4.14,-1.27; 19 -1.372,-1.27; 20 1.372,-1.27; 21 4.14,-1.27; 22 6.909,-1.27; 23 9.652,-1.27; 24 12.421,-1.27; 25 15.189,-1.27 | drill 3.302 pad 5.08: G1 -23.52,0; G2 23.52,0
M0805 = smd 1.3 x 1.6: 1 -0.95,0; 2 0.95,0
R0805 = smd 1.3 x 1.5: 1 -0.95,0; 2 0.95,0
SOT23 = smd 1 x 1.4: 1 -0.95,-1.1; 2 0.95,-1.1; 3 0,1.1
TO126V = drill 1.016 long: 1 -2.603,-1.27; 2 0,-1.27; 3 2.603,-1.27
TO220FV = drill 1.016 long: 1 -2.54,-2.54; 2 0,-2.54; 3 2.54,-2.54
2X20 = drill 1.016 octagon: 1 -24.13,-1.27; 2 -24.13,1.27; 3 -21.59,-1.27; 4 -21.59,1.27; 5 -19.05,-1.27; 6 -19.05,1.27; 7 -16.51,-1.27; 8 -16.51,1.27; 9 -13.97,-1.27; 10 -13.97,1.27; 11 -11.43,-1.27; 12 -11.43,1.27; 13 -8.89,-1.27; 14 -8.89,1.27; 15 -6.35,-1.27; 16 -6.35,1.27; 17 -3.81,-1.27; 18 -3.81,1.27; 19 -1.27,-1.27; 20 -1.27,1.27; 21 1.27,-1.27; 22 1.27,1.27; 23 3.81,-1.27; 24 3.81,1.27; 25 6.35,-1.27; 26 6.35,1.27; 27 8.89,-1.27; 28 8.89,1.27; 29 11.43,-1.27; 30 11.43,1.27; 31 13.97,-1.27; 32 13.97,1.27; 33 16.51,-1.27; 34 16.51,1.27; 35 19.05,-1.27; 36 19.05,1.27; 37 21.59,-1.27; 38 21.59,1.27; 39 24.13,-1.27; 40 24.13,1.27
HC49U-LM = drill 0.813: 1 -2.413,-5.08; 2 2.413,-5.08; M -5.715,3.81; M1 5.715,3.81

### Placement (x,y rotation side)
C1N  -19.05,-138.43 90 bottom
C2N  127.64,-105.41 180 bottom
C3N  207.65,-119.38 0 top
C4N  214,-119.38 0 top
C5  80.64,67.94 180 bottom
C6  80.64,62.23 0 bottom
C8  57.15,109.86 90 bottom
CX2  133.35,-115.57 0 bottom
CX49  151.76,-71.12 90 bottom
DA12  133.35,-114.3 90 top
DA13  153.03,-71.12 0 top
DD1  15.88,118.11 0 top
DD2  13.34,130.81 0 top
DD4  74.3,-119.38 90 top
DD5  53.98,-119.38 90 top
DD6  33.66,-119.38 90 top
DD7  13.34,-119.38 90 top
DD8  33.66,-114.3 90 top
DD9  13.34,-144.78 90 top
DD10  15.88,-87 0 top
DD11  13.34,-114.3 90 top
DD15  -78.74,46.35 0 top
DD16  -61.59,49.53 0 top
DD17  -40.64,40.64 0 top
DD24  106.05,-56.52 270 top
DD26  -19.05,-132.08 90 top
DD27  123.19,-146.05 270 top
DD28  -72.39,27.3 0 top
DD29  15.88,144.15 0 top
DP1U/N  14.61,-1.91 180 top
DP2U/N  40.01,-1.27 180 top
DP3U/N  66.67,-1.91 180 top
DP4U/N(11)  17.14,87 0 top
DP5U/N  19.05,49.53 0 top
DP6U/N  20.32,11.43 0 top
DP7U/DP8N  61.59,48.9 0 top
DP8U/DP9N  62.87,16.51 0 top
DP9U/DP10N  20.95,28.57 0 top
DP10U  59.05,87 0 top
DP11N  17.14,68.58 0 top
DP11U/DP12N  59.05,68.58 0 top
LPT26PINS  19.68,156.84 0 top
LPTDB25_  -74.3,-251.46 0 top
R1/R87N  141.6,-100.97 180 bottom
R1A  -99.69,56.52 0 top
R1B  -89.53,62.87 0 bottom
R1C  -85.09,34.29 0 bottom
R1D  -85.09,39.37 0 bottom
R5A  -64.14,27.3 90 bottom
R5B  -69.22,27.3 90 bottom
R5C  -74.3,27.3 90 bottom
R5D  -79.38,27.3 90 bottom
R5E  -81.92,27.3 90 bottom
R5F  -66.67,27.94 270 bottom
R5G  -71.75,27.94 270 bottom
R5H  -76.83,27.94 270 bottom
R10  -92.71,57.78 0 bottom
R11  -89.53,34.92 0 bottom
R38/R88N  140.97,-118.11 0 bottom
R46/R89N  141.6,-104.14 180 bottom
R50/R90N  142.24,-109.22 270 bottom
R54/R91N  157.48,-108.58 270 bottom
R65  64.14,114.94 180 bottom
R67  66.04,112.39 90 bottom
R68  53.34,-92.71 180 bottom
R92N  159.38,-122.56 180 bottom
R93N  134.62,-106.05 0 bottom
R94N  138.43,-130.18 180 bottom
R95N  148.59,-127.64 180 bottom
R96N  160.66,-127.64 0 bottom
R97N  205.1,-113.03 0 top
R98N  202.56,-104.78 0 top
R99N  214,-104.78 0 top
R100N  225.43,-104.78 0 top
R101  193.68,-113.03 0 top
R102N  215.26,-113.03 0 top
R103N  222.25,-113.03 0 top
R104N  229.24,-113.03 0 top
R105N  193.68,-119.38 0 top
R106N  200.66,-119.38 0 top
VT1  -93.34,61.59 0 bottom
VT2  -89.53,38.1 0 bottom
VT29N  144.78,-108.58 90 top
VT30N  149.22,-132.08 180 top
VT31N  207.65,-93.34 0 top
VT32N  216.53,-93.34 0 top
VT33N  154.31,-108.58 270 top
VT34N  159.38,-133.35 180 top
VT35N  232.41,-81.28 0 top
VT36N  197.49,-93.34 0 top
VT37N  148.59,-102.23 180 top
VT38N  154.31,-128.27 180 top
VT39N  225.43,-93.34 0 top
VT40N  196.22,-102.87 0 top
VT41  71.75,114.94 90 bottom
X1  40.64,-191.13 90 top
X2  54.61,31.11 180 top
Z1  71.75,65.41 90 top

### Tracks (layer width: path | path; a pad name or v marks a point on that pad's centre or on a via)
!ADWR  (2 unrouted)
  Bottom 0.406: LPT26PINS.2 5.71,156.84 5.71,144.15 3.17,141.6 3.17,138.43 5.71,135.89 5.71,123.19 DD1.19
!EN1  (3 unrouted)
!EN2  (3 unrouted)
!EN3  (3 unrouted)
!EN4  (3 unrouted)
!IORD  (3 unrouted)
  Bottom 0.406: DD7.5 22.86,-133.35 24.13,-132.08 38.1,-132.08 39.37,-133.35 DD6.5 43.18,-133.35 44.45,-132.08 58.42,-132.08 59.69,-133.35 DD5.5 63.5,-133.35 64.77,-132.08 78.74,-132.08 80.01,-133.35 DD4.5
!IOWR  (1 unrouted)
  Bottom 0.406: DD7.36 17.78,-133.35 19.05,-134.62 24.77,-134.62 DD6.36 37.47,-133.35 38.73,-134.62 45.09,-134.62 DD5.36 58.42,-133.35 59.69,-134.62 65.41,-134.62 DD4.36
!RDI  (1 unrouted)
!RSS  (1 unrouted)
+5V  (15 unrouted)
  Bottom 0.406: DD29.20 4.45,144.78 2.54,142.88 2.54,137.79 4.45,135.89 DD2.16 4.45,131.44 3.17,130.18 3.17,123.19 DD1.20 DD1.1 | DD4.26 64.77,-107.95 63.5,-109.22 60.33,-109.22 59.05,-107.95 DD5.26 45.09,-107.95 43.81,-106.68 36.2,-106.68 34.92,-107.95 DD6.26 25.4,-107.95 24.13,-109.22 15.88,-109.22 14.61,-107.95 12.7,-107.95 11.43,-106.68 8.26,-106.68 6.99,-107.95 DD7.26
+7V  (3 unrouted)
+14V  (3 unrouted)
+27V  (10 unrouted)
  Bottom 0.406: VT30N.2 149.22,-133.99 159.38,-133.99 VT34N.2
-5V  (7 unrouted)
BQ1  (2 unrouted)
BQ2  (2 unrouted)
D0  (3 unrouted)
  Bottom 0.406: DD7.34 17.14,-128.27 18.41,-129.54 23.5,-129.54 24.77,-128.27 DD6.34 37.47,-128.27 38.73,-129.54 43.18,-129.54 44.45,-128.27 DD5.34 56.52,-128.27 57.78,-129.54 64.14,-129.54 65.41,-128.27 DD4.34
D1  (3 unrouted)
  Bottom 0.406: DD7.33 17.78,-125.73 19.05,-127 22.86,-127 24.13,-125.73 DD6.33 37.47,-125.73 38.73,-127 43.18,-127 44.45,-125.73 DD5.33 58.42,-125.73 59.69,-127 63.5,-127 64.77,-125.73 DD4.33
D2  (4 unrouted)
  Bottom 0.406: 17.78,-123.19 19.05,-124.46 22.86,-124.46 24.13,-123.19 DD6.32 37.47,-123.19 38.73,-124.46 43.18,-124.46 44.45,-123.19 DD5.32 58.42,-123.19 59.69,-124.46 63.5,-124.46 64.77,-123.19 DD4.32
D3  (3 unrouted)
  Bottom 0.406: DD4.31 64.77,-120.65 63.5,-121.92 60.33,-121.92 59.05,-120.65 DD5.31 44.45,-120.65 43.18,-121.92 38.73,-121.92 34.92,-120.65 DD6.31 24.13,-120.65 22.86,-121.92 15.88,-121.92 14.61,-120.65 12.7,-120.65 11.43,-121.92 8.26,-121.92 6.99,-120.65 DD7.31
D4  (3 unrouted)
  Bottom 0.406: DD4.30 65.41,-118.11 64.14,-119.38 60.33,-119.38 59.05,-118.11 DD5.30 45.09,-118.11 43.81,-116.84 36.2,-116.84 34.92,-118.11 DD6.30 24.77,-118.11 23.5,-119.38 15.24,-119.38 13.97,-118.11 12.7,-118.11 11.43,-119.38 8.26,-119.38 6.99,-118.11 DD7.30
D5  (3 unrouted)
  Bottom 0.406: DD4.29 64.77,-115.57 63.5,-116.84 59.69,-116.84 58.42,-115.57 DD5.29 45.09,-115.57 43.81,-114.3 36.2,-114.3 34.92,-115.57 DD6.29 24.77,-115.57 23.5,-116.84 15.88,-116.84 14.61,-115.57 12.7,-115.57 11.43,-114.3 8.26,-114.3 6.99,-115.57 DD7.29
D6  (3 unrouted)
  Bottom 0.406: DD4.28 64.77,-113.03 63.5,-114.3 59.69,-114.3 58.42,-113.03 DD5.28 44.45,-113.03 43.18,-111.76 36.2,-111.76 34.92,-113.03 DD6.28 24.77,-113.03 23.5,-114.3 15.24,-114.3 13.97,-113.03 13.34,-113.03 12.06,-111.76 6.99,-111.76 DD7.28
D7  (3 unrouted)
  Bottom 0.406: DD4.27 64.77,-110.49 63.5,-111.76 59.69,-111.76 58.42,-110.49 DD5.27 45.09,-110.49 43.81,-109.22 36.2,-109.22 34.92,-110.49 DD6.27 24.77,-110.49 23.5,-111.76 15.24,-111.76 12.7,-109.22 8.26,-109.22 6.99,-110.49 DD7.27
E1  (7 unrouted)
E2  (5 unrouted)
  Bottom 0.406: VT38N.1 160.66,-125.73 163.83,-126.36 VT34N.1
E3  (4 unrouted)
E4  (6 unrouted)
GND  (47 unrouted)
  Bottom 0.406: LPT26PINS.10 LPT26PINS.12 LPT26PINS.14 LPT26PINS.16 LPT26PINS.18 LPT26PINS.20 LPT26PINS.22 LPT26PINS.24 LPT26PINS.26 | DD29.10 27.3,145.41 26.04,146.69 26.04,151.76 25.4,152.4 | DD2.15 6.99,136.53 4.45,139.06 DD29.1 | DD7.7 22.86,-128.27 24.13,-127 37.47,-127 38.73,-128.27 DD6.7 43.18,-128.27 44.45,-127 57.78,-127 59.05,-128.27 DD5.7 63.5,-128.27 64.77,-127 78.11,-127 79.38,-128.27 DD4.7 | DD8.2 DD8.3
N$1  (1 unrouted)
N$2  (1 unrouted)
N$5  (2 unrouted)
N$6  (1 unrouted)
N$7  (1 unrouted)
N$8  (1 unrouted)
N$9  (1 unrouted)
N$10  (1 unrouted)
N$11  (2 unrouted)
N$12  (1 unrouted)
N$13  (1 unrouted)
N$14  (2 unrouted)
N$15  (2 unrouted)
N$16  (3 unrouted)
N$17  (2 unrouted)
N$18  (3 unrouted)
N$19  (3 unrouted)
N$22  (1 unrouted)
N$23  (1 unrouted)
N$24  (2 unrouted)
N$25  (2 unrouted)
  Bottom 0.406: VT30N.1 VT34N.3
N$26  (2 unrouted)
  Bottom 0.406: VT30N.3 146.62,-126.43 149.22,-123.83 VT38N.3
N$27  (3 unrouted)
N$28  (1 unrouted)
N$29  (1 unrouted)
N$30  (2 unrouted)
N$31  (3 unrouted)
N$32  (3 unrouted)
P0  (1 unrouted)
P1  (1 unrouted)
P8  (1 unrouted)
P9  (1 unrouted)
P64  (1 unrouted)
P65  (1 unrouted)
P66  (1 unrouted)
P67  (1 unrouted)
P68
  Bottom 0.406: DD8.5 DD6.13
P69
  Bottom 0.406: DD8.4 DD6.12
P70  (1 unrouted)
P71  (1 unrouted)
P72  (1 unrouted)
P73
  Bottom 0.406: DD9.8 DD7.3
P74
  Bottom 0.406: DD9.7 DD7.2
P75
  Bottom 0.406: DD9.6 DD7.1
P76  (1 unrouted)
P77  (1 unrouted)
P78  (1 unrouted)
P79  (1 unrouted)
P80  (1 unrouted)
P81  (1 unrouted)
P82  (1 unrouted)
P83  (1 unrouted)
P84  (1 unrouted)
P85  (1 unrouted)
P86  (1 unrouted)
P87  (1 unrouted)
P88  (1 unrouted)
P89  (1 unrouted)
P90  (1 unrouted)
P91  (1 unrouted)
P92
  Bottom 0.406: DD11.5 DD7.13
P93
  Bottom 0.406: DD7.12 DD11.4
P94  (1 unrouted)
P95  (1 unrouted)
PA0  (2 unrouted)
PA1  (2 unrouted)
PA8  (1 unrouted)
PA9  (1 unrouted)
PA10  (1 unrouted)
PA11  (1 unrouted)
PA12  (1 unrouted)
PA13  (2 unrouted)
PA14  (2 unrouted)
PA15  (2 unrouted)
PA16  (1 unrouted)
PD0  (2 unrouted)
PD1  (2 unrouted)
PD2  (2 unrouted)
PD3  (2 unrouted)
PD4  (1 unrouted)
PD5  (1 unrouted)
PD6  (1 unrouted)
PD7  (1 unrouted)
PD8  (1 unrouted)
PD9  (1 unrouted)
PD10  (1 unrouted)
PD11  (2 unrouted)
PD13  (1 unrouted)
PD14  (1 unrouted)
PD15  (1 unrouted)
R16CS  (2 unrouted)
RES  (1 unrouted)
  Bottom 0.406: DD7.35 17.78,-130.81 19.05,-132.08 22.86,-132.08 24.13,-130.81 DD6.35 39.37,-130.81 40.64,-132.08 43.18,-132.08 44.45,-130.81 DD5.35 59.05,-130.81 60.33,-132.08 63.5,-132.08 64.77,-130.81 DD4.35
VCC  (3 unrouted)
XA0  (1 unrouted)
  Bottom 0.406: DD7.9 22.86,-123.19 24.13,-121.92 35.56,-121.92 40.01,-123.19 DD6.9 43.18,-123.19 44.45,-121.92 58.42,-121.92 59.69,-123.19 DD5.9 63.5,-123.19 64.77,-121.92 78.11,-121.92 79.38,-123.19 DD4.9
XA1  (1 unrouted)
  Bottom 0.406: DD7.8 22.86,-125.73 24.13,-124.46 37.47,-124.46 38.73,-125.73 DD6.8 43.18,-125.73 44.45,-124.46 58.42,-124.46 59.69,-125.73 DD5.8 63.5,-125.73 64.77,-124.46 78.74,-124.46 80.01,-125.73 DD4.8
XA3  (1 unrouted)
XA4  (1 unrouted)
XA5  (1 unrouted)
XA6  (1 unrouted)
XA7  (1 unrouted)
XD0
  Bottom 0.406: LPT26PINS.3 6.99,151.76 8.26,150.5 8.26,141.6 DD29.3 9.53,137.16 8.26,135.89 8.26,115.57 DD1.2
XD1
  Bottom 0.406: LPT26PINS.5 9.53,152.4 10.79,151.13 10.79,141.6 DD29.4 12.06,137.16 10.79,135.89 10.79,117.47 9.53,116.2 DD1.3
XD2
  Bottom 0.406: LPT26PINS.7 12.06,151.13 13.34,149.86 13.34,143.51 13.97,142.88 | 13.97,142.88 19.05,142.88 19.68,142.24 DD29.7 | DD1.4 12.06,118.75 13.34,120.02 13.34,142.24 13.97,142.88
XD3
  Bottom 0.406: LPT26PINS.9 14.61,150.5 15.88,149.22 15.88,145.41 16.51,144.78 19.68,144.78 22.23,142.24 DD29.8 22.23,139.06 20.95,137.79 17.14,137.79 15.88,136.53 15.88,118.11 14.61,116.84 DD1.5
XD4  (1 unrouted)
  Bottom 0.406: DD29.13 22.23,146.05 | 22.23,146.05 22.23,143.51 23.5,142.24 23.5,138.43 22.23,137.16 19.68,137.16 18.41,135.89 18.41,118.11 17.14,116.84 DD1.6 | 17.14,154.31 17.14,151.13 18.41,149.86 18.41,146.69 19.05,146.05 22.23,146.05
XD5  (1 unrouted)
  Bottom 0.406: LPT26PINS.13 DD29.14
XD6  (1 unrouted)
  Bottom 0.406: LPT26PINS.15 22.23,150.5 23.5,149.22 23.5,144.15 26.04,141.6 26.04,127 23.5,124.46 23.5,118.11 22.23,116.84 DD1.8
XD7
  Bottom 0.406: DD29.18 9.53,150.5 8.26,151.76 8.26,156.21 8.89,156.84 23.5,156.84 LPT26PINS.17 29.21,151.13 29.21,139.7 27.3,137.79 27.3,126.36 26.04,125.09 26.04,120.02 24.77,118.75 DD1.9
XI0  (1 unrouted)
  Bottom 0.406: LPT26PINS.25 34.92,153.03 36.83,151.13 36.83,134.62 31.75,129.54
XI1  (1 unrouted)
  Bottom 0.406: LPT26PINS.23 32.38,153.67 34.29,151.76 34.29,137.16 29.84,132.72
XI2  (1 unrouted)
  Bottom 0.406: LPT26PINS.19 27.3,154.94 30.48,151.76 30.48,136.53 28.57,134.62
XI3  (1 unrouted)
  Bottom 0.406: LPT26PINS.21 29.84,154.31 31.75,152.4 31.75,137.16
XI4
  Bottom 0.406: LPT26PINS.1 4.45,152.4 1.91,149.86 1.91,129.54 DD2.1